# EasyEDA Pro project CyberryPotter.epro

# Schematic Development
Board Name: Development; Create Date: 2024-08-22; Page Name: P1; Project Name: 赛博魔杖_STM32卷积神经网络; Schematic Name: Development; Update Date: 2024-08-23; Company: 嘉立创EDA; Page Size: A4; Version: V1.0
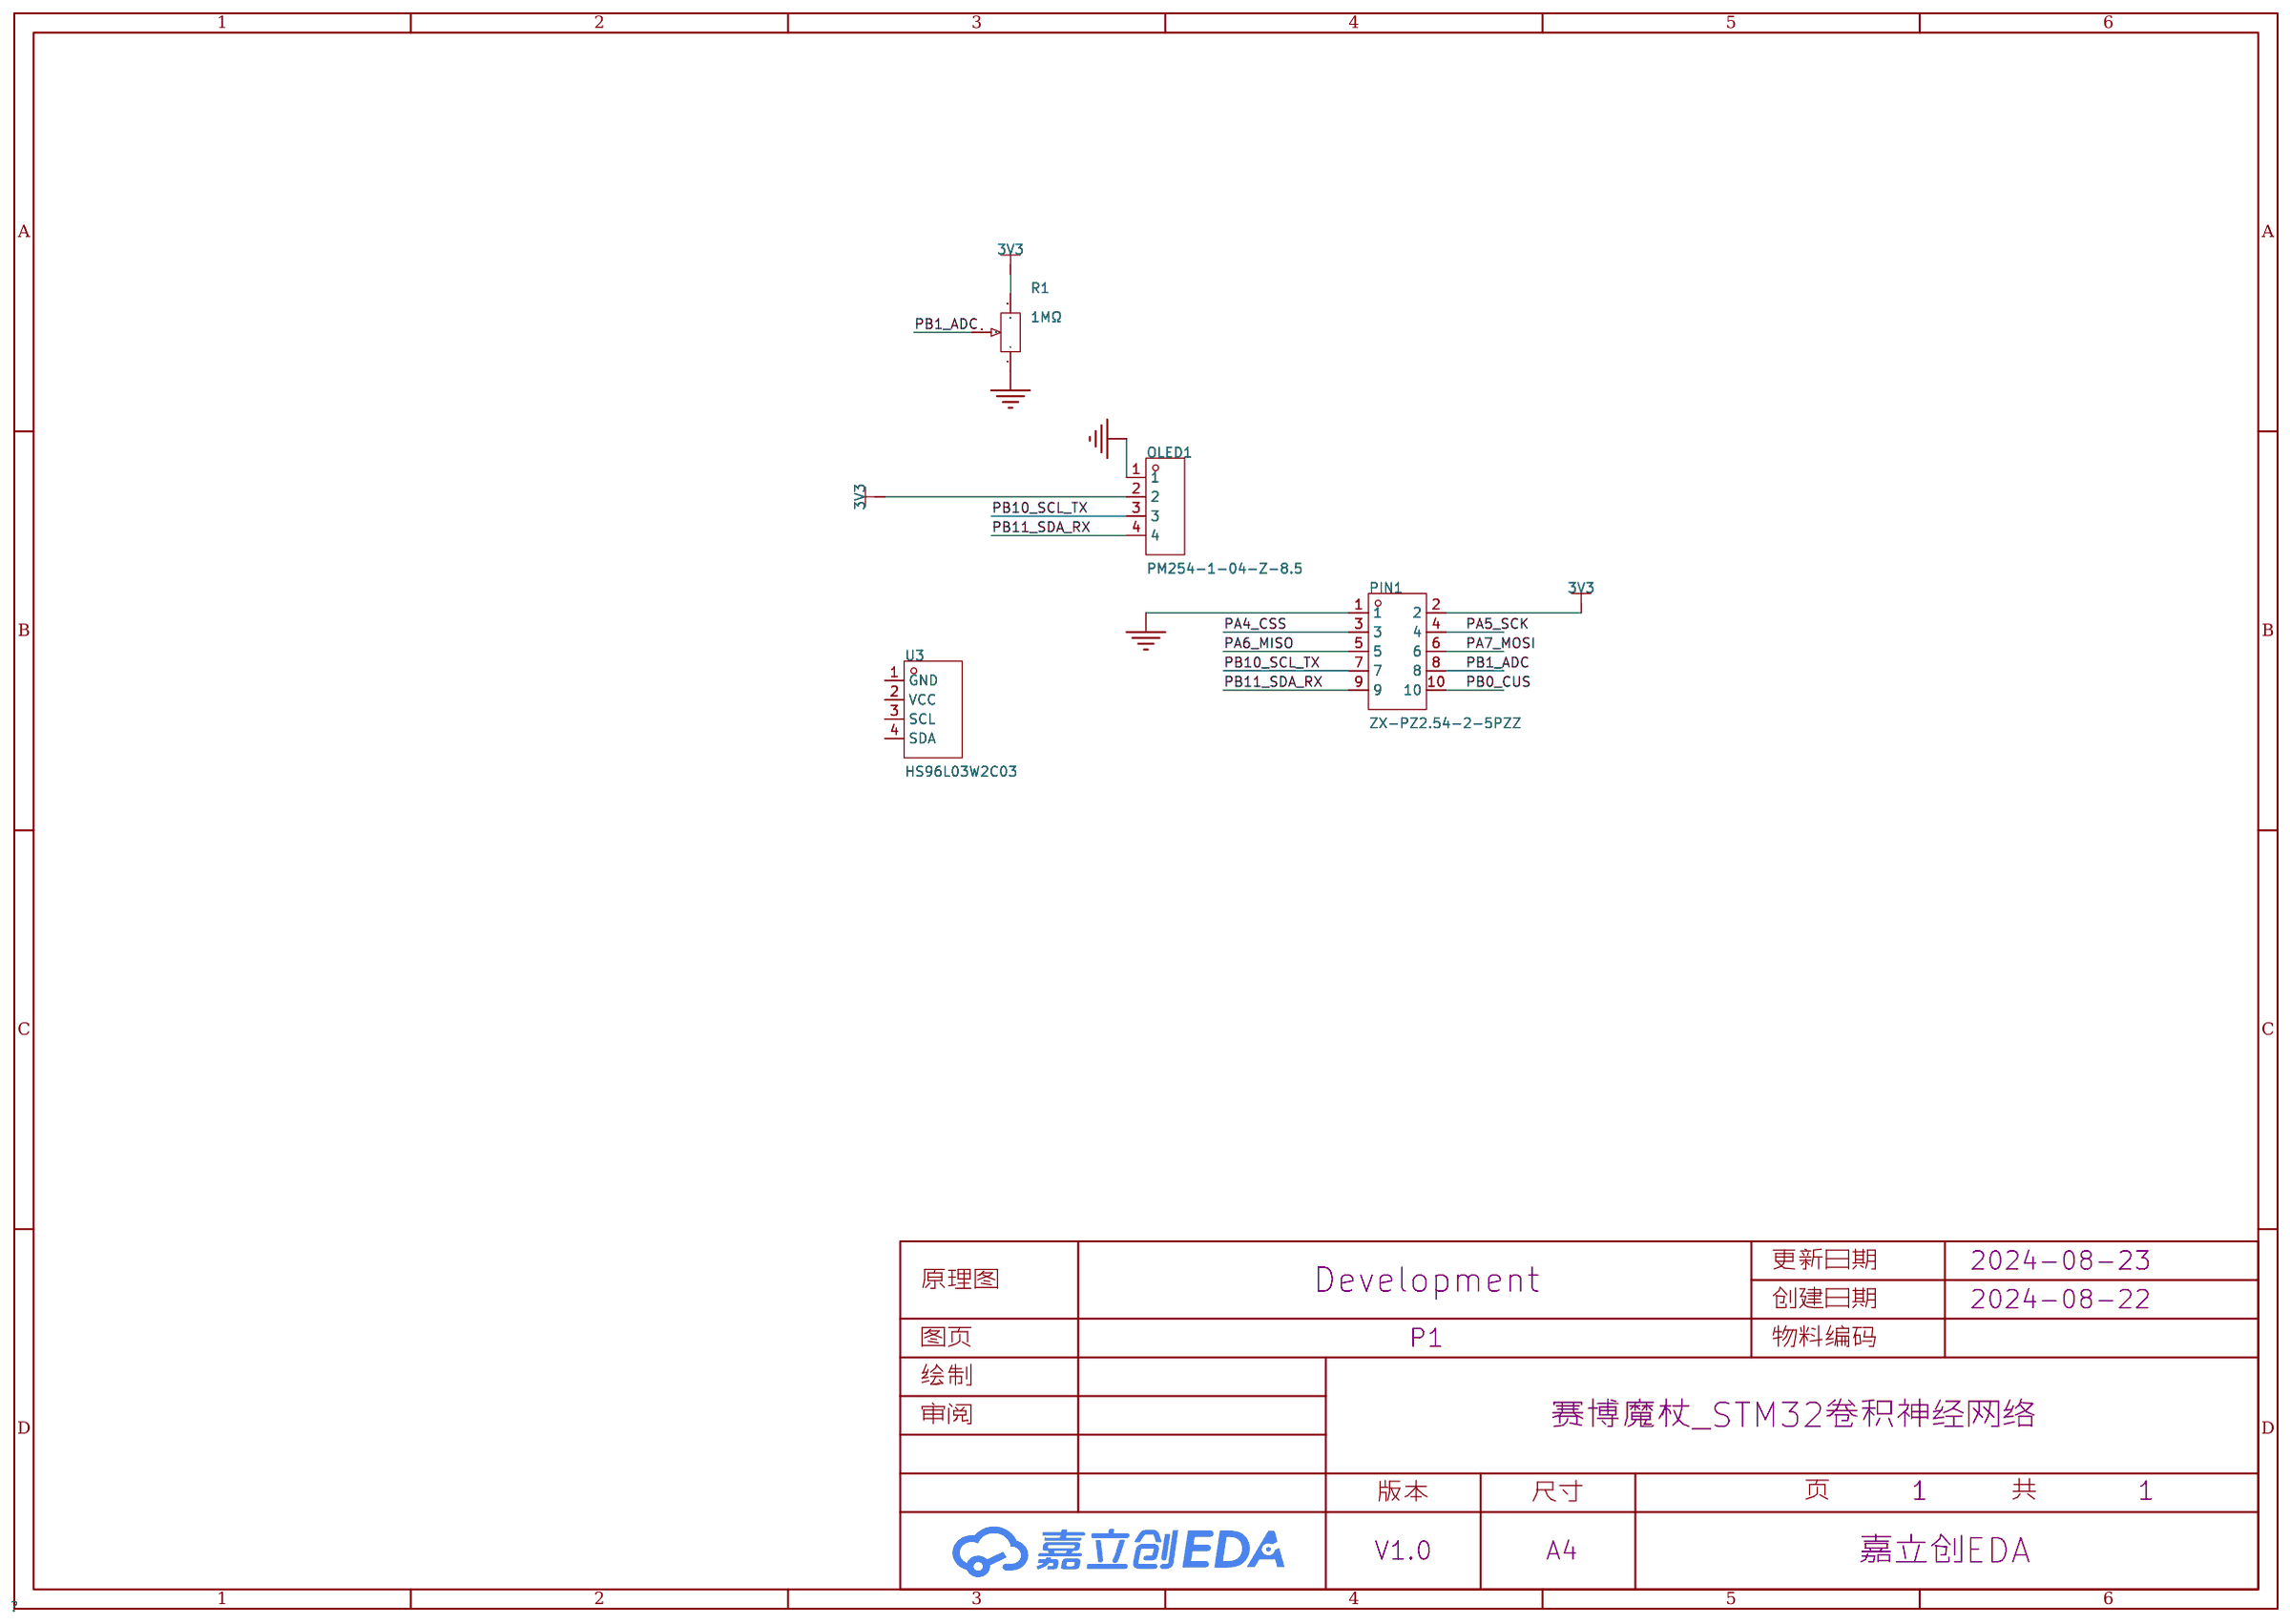
[diagram p0: schematic sheet]

## Parts
OLED1  PM254-1-04-Z-8.5  [HDR-TH_4P-P2.54-V-F]
PIN1  ZX-PZ2.54-2-5PZZ  [HDR-TH_10P-P2.54-V-M-R2-C5-S2.54]
R1  1MΩ  [RES-ADJ-TH_3P-L9.5-W4.9-P2.50-L_3296W]
U3  HS96L03W2C03  [OLED-TH_L27.8-W27.2-P2.54_C9900033791]

## Library data of the parts
OLED1 = PM254-1-04-Z-8.5_C2897367: 插孔结构:1x4P;间距:2.54mm;行距:-;圆孔/方孔:方孔;安装类型:直插;排数:单排;总孔位数:4P;额定电流:3A;额定电压:-;插孔方向:顶部;塑高:8.5mm;触头材质:铜合金;工作温度范围:-40℃~+105℃;焊接温度(最大值):260℃@5S;; LCSC Part Name: 1x4P 间距:2.54mm 直插; Supplier Part: C2897367; Manufacturer: HCTL(华灿天禄); Supplier Footprint: 插件,P=2.54mm; JLCPCB Part Class: 扩展库; Datasheet: https://atta.szlcsc.com/upload/public/pdf/source/20230609/534BE42964C679BDE98E061007C4ABD6.pdf; Supplier: LCSC; Holes Structure: 1x4P; Pitch: 2.54mm; Circular Hole / Square Hole: 方孔; Mounting Type: 直插; Number of Rows: 单排; Number of Holes: 4P; Current Rating (Max): 3A; Holes Direction: 顶部; Insulation Height: 8.5mm; Contact Material: 铜合金; Operating Temperature Range: -40℃~+105℃; Soldering Temperature(Max): 260℃@5S
PIN1 = ZX-PZ2.54-2-5PZZ: 插针结构:2x5P;间距:2.54mm;行距:2.54mm;圆针/方针:方针;安装类型:直插;排数:双排;总PIN位数:10P;额定电流:3A;额定电压:1kV;配合针长度:6mm;塑高:2.5mm;端接针长度:3mm;触头材质:黄铜;触头镀层:金;工作温度范围:-40℃~+105℃;焊接温度(最大值):-;颜色:黑色;; LCSC Part Name: 2x5P 间距:2.54mm 方针 直插; Supplier Part: C7501276; Manufacturer: Megastar(兆星); Supplier Footprint: 插件,P=2.54mm; JLCPCB Part Class: 扩展库; Datasheet: https://atta.szlcsc.com/upload/public/pdf/source/20231122/7DD2FA5A7FDBC10CDDB6051CB6BC6AD1.pdf; Supplier: LCSC; Pin Structure: 2x5P; Pitch: 2.54mm; Row Spacing: 2.54mm; Circluar Pins/Square Pins: 方针; Mounting Type: 直插; Number of Rows: 双排; Number of Pins: 10P; Current Rating (Max): 3A; Voltage Rating (Max): 1kV; Length of Mating Pin: 6mm; Insulation Height: 2.5mm; Length of End Connection Pin: 3mm; Contact Material: 黄铜; Contact Plating: 金; Operating Temperature Range: -40℃~+105℃; Color: 黑色
R1 = 3296W-1-104: 阻值:100kΩ;精度:±10%;; LCSC Part Name: 100kΩ ±10%; Supplier Part: C118963; Manufacturer: BOCHEN(博晨); Supplier Footprint: 插件; JLCPCB Part Class: 扩展库; Datasheet: https://atta.szlcsc.com/upload/public/pdf/source/20171114/C118963_15106326662041117450.pdf; Supplier: LCSC; Tolerance: ±10%
U3 = HS96L03W2C03: 主控芯片:SSD1315;接口类型:I2C;尺寸(inch):0.96;像素分辨率:128x64;; LCSC Part Name: 0.96寸OLED显示屏窄白光IIC; Supplier Part: C5248080; Manufacturer: HS(汉昇); JLCPCB Part Class: 扩展库; Datasheet: https://atta.szlcsc.com/upload/public/pdf/source/20230627/763D01F79A90007632F098068C7C8AD9.pdf; Supplier: LCSC; Main Control Chip: SSD1315; Interface Type: I2C; Size: 0.96; Pixel Resolution: 128x64; Operating Temperature: -40℃~+70℃

## Nets
3V3: OLED1.2 PIN1.2 R1.3
GND: OLED1.1 PIN1.1 R1.1
PA4_CSS: PIN1.3
PA5_SCK: PIN1.4
PA6_MISO: PIN1.5
PA7_MOSI: PIN1.6
PB0_CUS: PIN1.10
PB1_ADC: PIN1.8 R1.2
PB10_SCL_TX: OLED1.3 PIN1.7
PB11_SDA_RX: OLED1.4 PIN1.9

Not connected (* = marked no-connect by the designer): U3 1(GND) 2(VCC) 3(SCL) 4(SDA)

# Schematic IR
Board Name: IR; Create Date: 2024-08-22; Page Name: P1; Project Name: 赛博魔杖_STM32卷积神经网络; Schematic Name: IR; Update Date: 2024-08-22
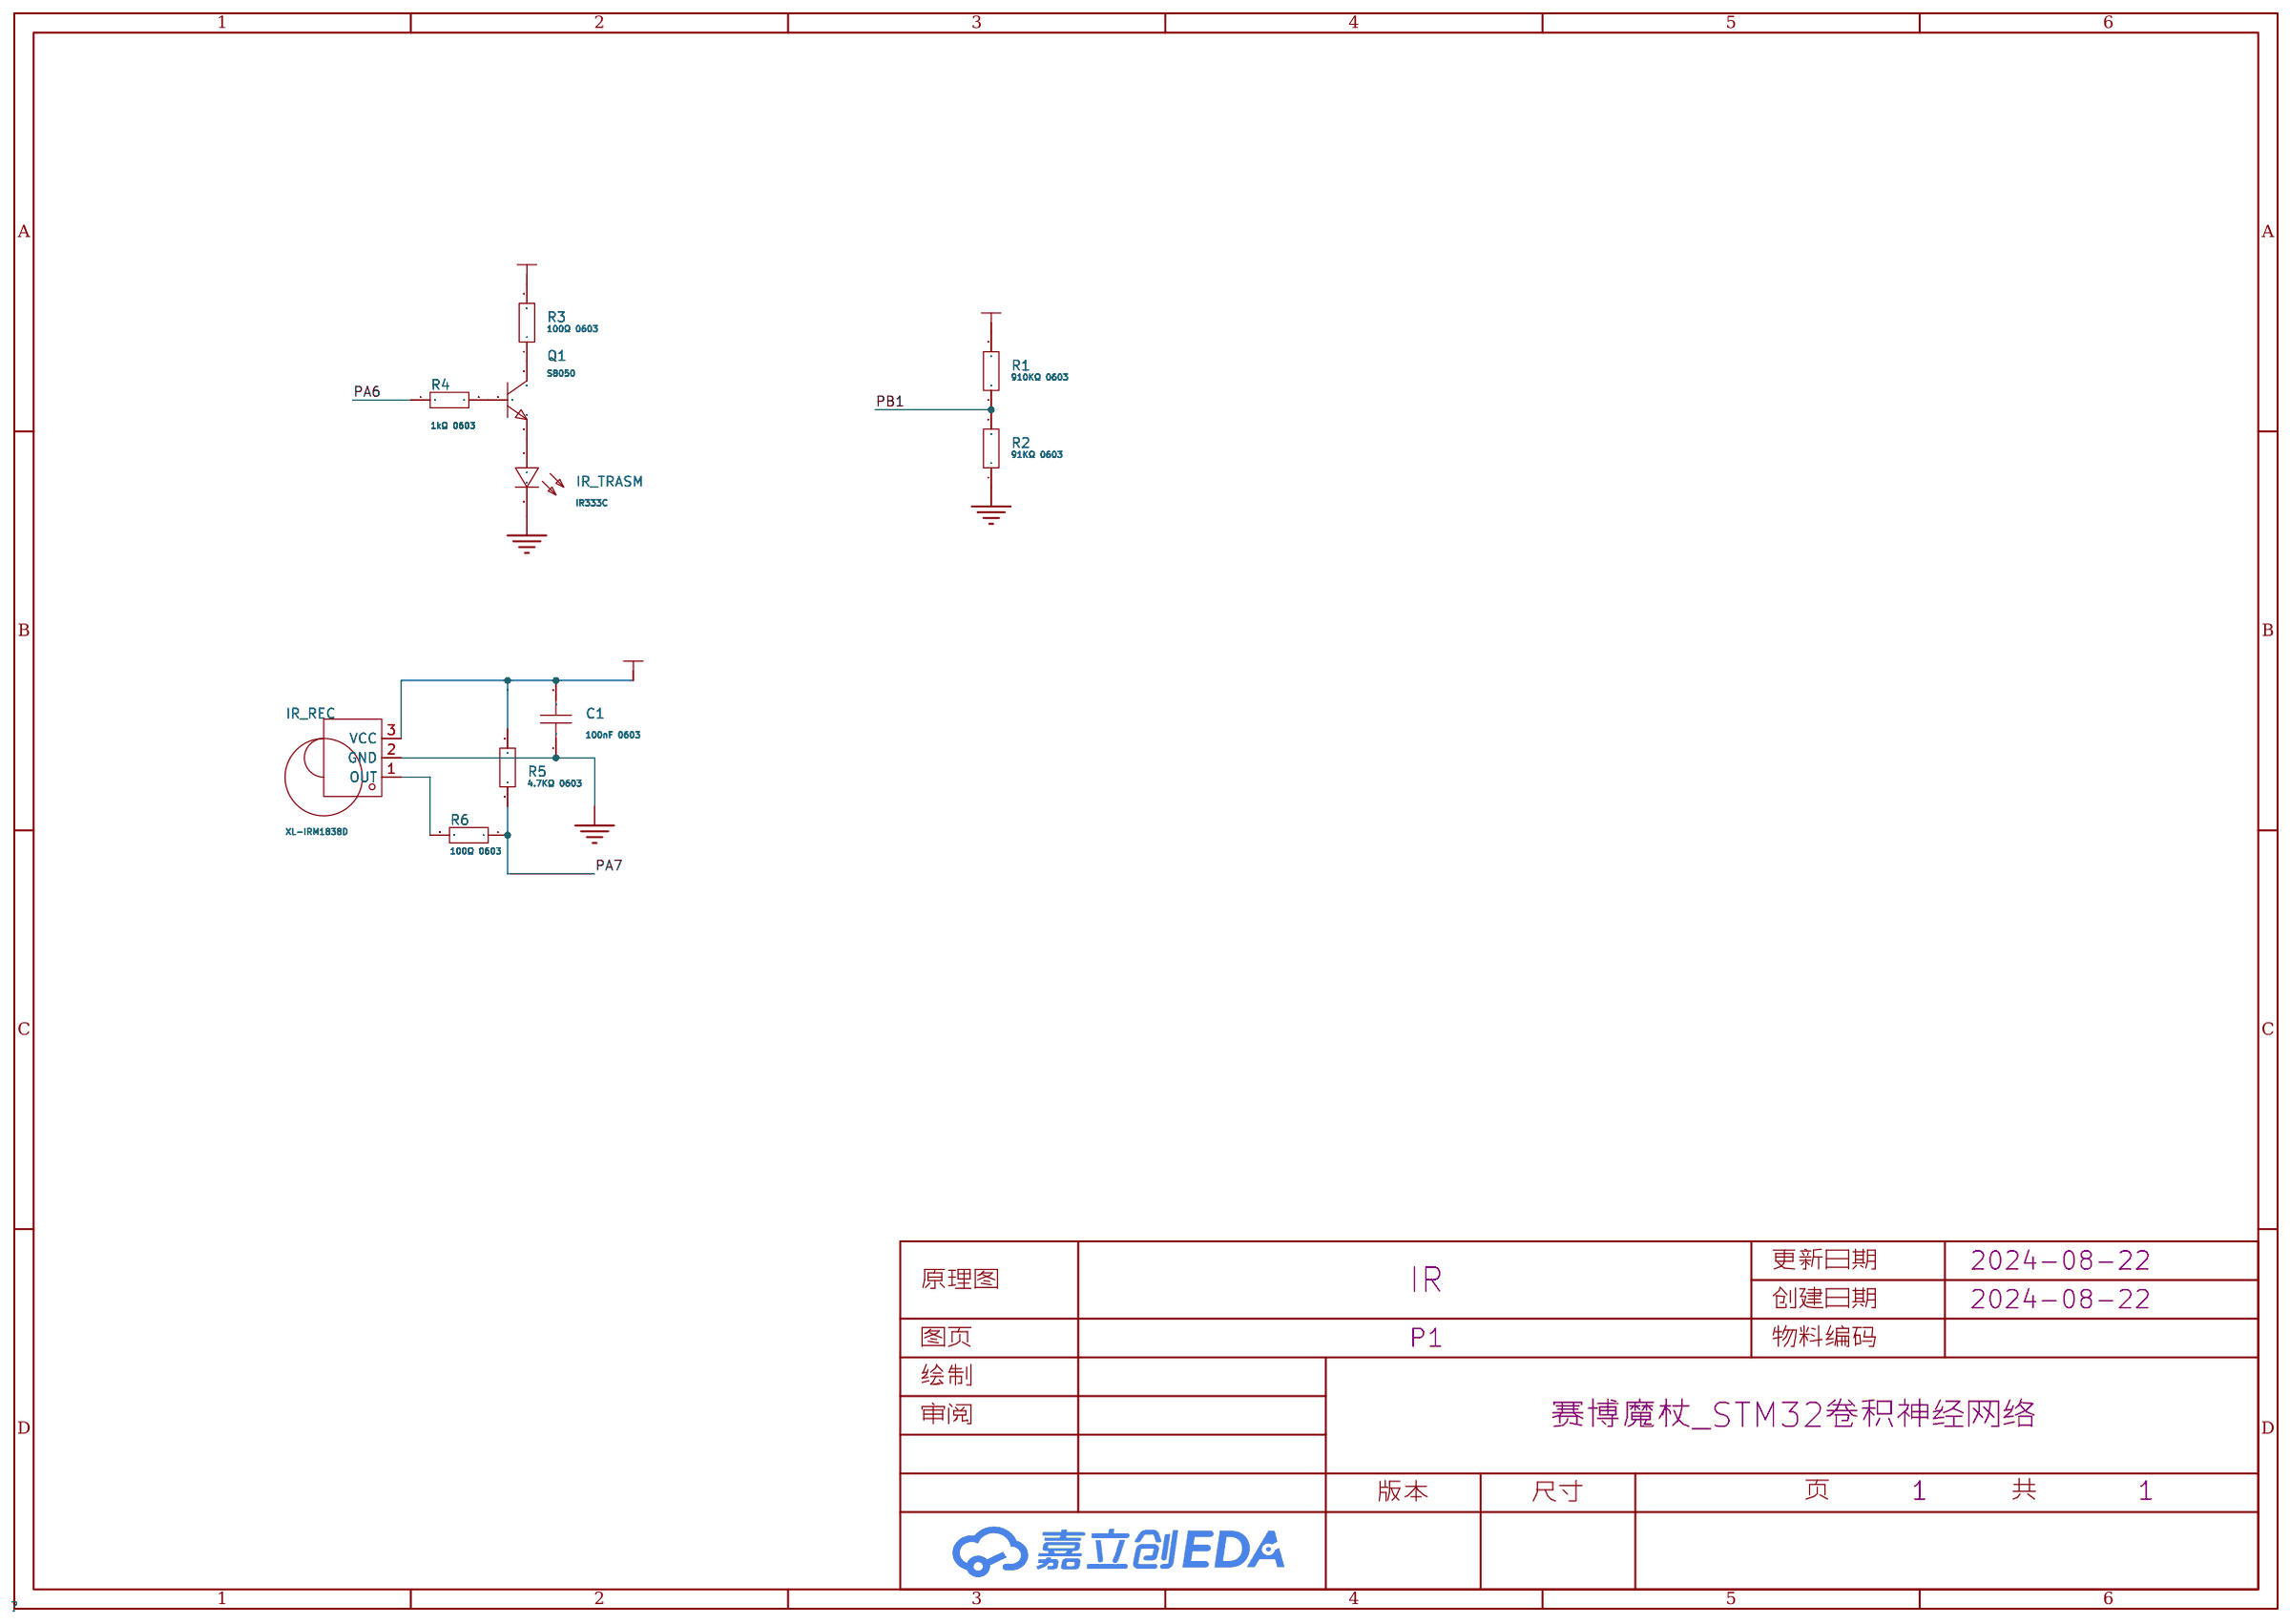
[diagram p1: schematic sheet]

## Parts
C1  100nF 0603  [C0603]
IR_REC  XL-IRM1838D  [OPTO-TH_3P-L7.0-W5.6-P2.54-L]
IR_TRASM  IR333C  [LED-TH_BD5.0-P2.54-FD]
Q1  S8050  [SOT-23-3_L2.9-W1.6-P1.90-LS2.8-BR]
R1  910KΩ 0603  [R0603]
R2  91KΩ 0603  [R0603]
R3  100Ω 0603  [R0603]
R4  1kΩ 0603  [R0603]
R5  4.7KΩ 0603  [R0603]
R6  100Ω 0603  [R0603]

## Library data of the parts
C1 = CC0603KRX7R9BB104: 容值:100nF;精度:±10%;额定电压:50V;材质(温度系数):X7R;; LCSC Part Name: 100nF ±10% 50V; Supplier Part: C14663; Manufacturer: YAGEO(国巨); Supplier Footprint: 0603; JLCPCB Part Class: 基础库; Datasheet: https://atta.szlcsc.com/upload/public/pdf/source/20180910/C282072_33301C7F631E79921B82A8DAC6BCC5B3.pdf; Supplier: LCSC; Tolerance: ±10%; Voltage Rated: 50V; Temperature Coefficient: X7R
IR_REC = XL-IRM1838D: D=7MM;载波频率：37.9KHZ;VDD=2.7-5.5V/插件式红外接收头;低功耗；宽角度及长距离接收/能抵挡环境干扰; Supplier Part: C19725374; Manufacturer: XINGLIGHT(成兴光); Supplier Footprint: SIP-3; JLCPCB Part Class: 扩展库; Datasheet: https://atta.szlcsc.com/upload/public/pdf/source/20240218/FB82743A9784255017BE11F358F9C065.pdf; Supplier: LCSC
IR_TRASM = IR333C: 正向电压:1.2V;波长:940nm;辐射强度:7.8mW/sr@20mA;视角:20°;; LCSC Part Name: 5mm红外LED; Supplier Part: C5200795; Manufacturer: EVERLIGHT(亿光); Supplier Footprint: 插件; JLCPCB Part Class: 扩展库; Datasheet: https://atta.szlcsc.com/upload/public/pdf/source/20221214/25ED07650BA98783E37095EC49136A18.pdf; Supplier: LCSC; Vf - Forward Voltage: 1.2V; Wavelength: 940nm; Radiant Intensity: 7.8mW/sr@20mA; View Angle: 20°; Operating Temperature: -40℃~+85℃
Q1 = S8050_C181158: 晶体管类型:NPN;集电极电流(Ic):500mA;集射极击穿电压(Vceo):25V;功率(Pd):300mW;; LCSC Part Name: NPN 电流:500mA 耐压:25V; Supplier Part: C181158; Manufacturer: Hottech(合科泰); Supplier Footprint: SOT-23; JLCPCB Part Class: 扩展库; Datasheet: https://atta.szlcsc.com/upload/public/pdf/source/20220506/D987F39D56F2975D34EC7947E75C4ABC.pdf; Supplier: LCSC; Transistor Type: NPN; Collector Current (Ic): 500mA; Collector-Emitter Breakdown Voltage (Vceo): 25V; Power Dissipation (Pd): 300mW; Transition Frequency (fT): 150MHz; Collector Cut-Off Current (Icbo): 100nA; Collector-Emitter Saturation Voltage (VCE(sat)@Ic,Ib): 600mV@500mA,50mA
R1-R6 = 0603WAF1002T5E: 电阻类型:厚膜电阻;阻值:10kΩ;精度:±1%;功率:100mW;最大工作电压:75V;温度系数:±100ppm/℃;; LCSC Part Name: 厚膜电阻 10kΩ ±1% 100mW; Supplier Part: C25804; Manufacturer: UNI-ROYAL(厚声); Supplier Footprint: 0603; JLCPCB Part Class: 基础库; Datasheet: https://atta.szlcsc.com/upload/public/pdf/source/20200306/C422600_1E6D84923E4A46A82E41ADD87F860B5C.pdf; Supplier: LCSC; Type: 厚膜电阻; Tolerance: ±1%; Power(Watts): 100mW; Overload Voltage (Max): 75V; Temperature Coefficient: ±100ppm/℃; Operating Temperature Range: -55℃~+155℃

## Nets
3V3: C1.2 IR_REC.3(VCC) R1.2 R3.2 R5.1
GND: C1.1 IR_REC.2(GND) IR_TRASM.2(C) R2.1
PA6: R4.1
PA7: R5.2 R6.1
PB1: R1.1 R2.2
$1N195: IR_TRASM.1(A) Q1.2
$1N793: Q1.1 R4.2
$1N835: Q1.3 R3.1
$1N1035: IR_REC.1(OUT) R6.2

# Schematic Main
Board Name: Main; Create Date: 2024-08-22; Page Name: P1; Project Name: 赛博魔杖_STM32卷积神经网络; Schematic Name: Main; Update Date: 2024-08-22
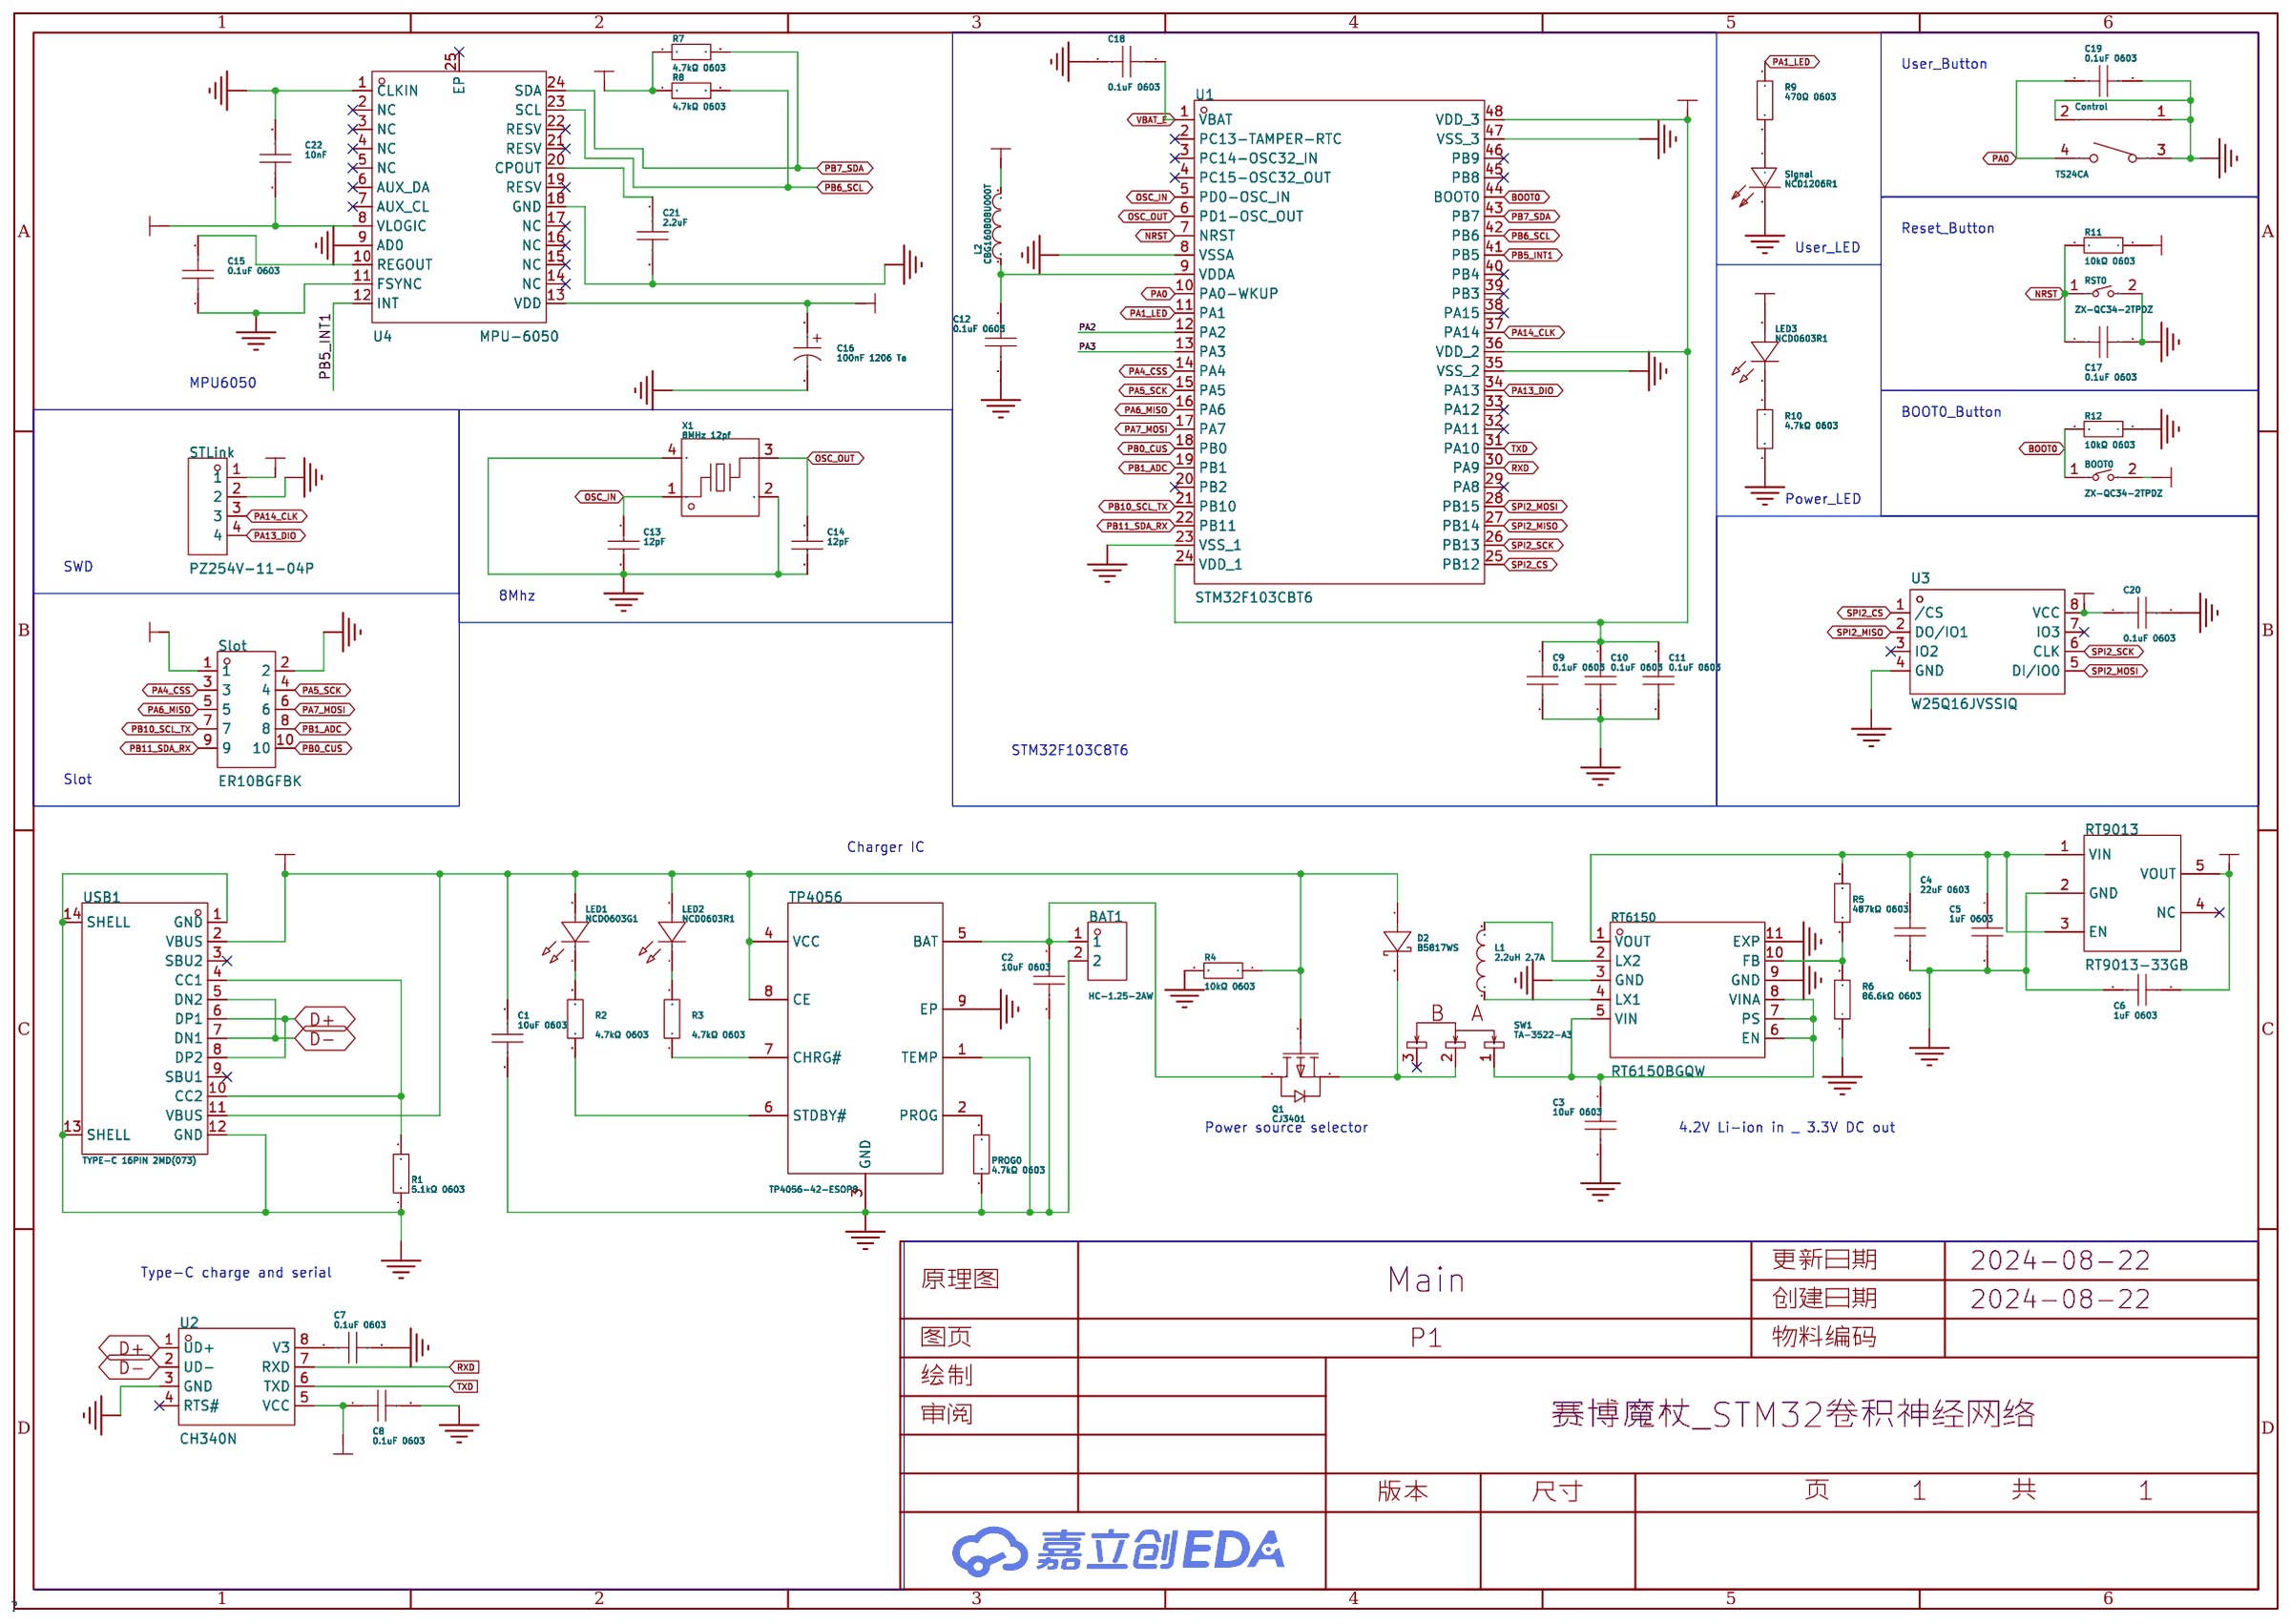
[diagram p2: schematic sheet]

## Parts
BAT1  HC-1.25-2AW  [CONN-TH_2P-P1.25_HCTL_HC-1.25-2AW]
BOOT0  ZX-QC34-2TPDZ  [KEY-SMD_L3.9-W3.0-LS5.0-EH]
C1  10uF 0603  [C0603]
C2  10uF 0603  [C0603]
C3  10uF 0603  [C0603]
C4  22uF 0603  [C0603]
C5  1uF 0603  [C0603]
C6  1uF 0603  [C0603]
C7  0.1uF 0603  [C0603]
C8  0.1uF 0603  [C0603]
C9  0.1uF 0603  [C0603]
C10  0.1uF 0603  [C0603]
C11  0.1uF 0603  [C0603]
C12  0.1uF 0603  [C0603]
C13  12pF  [C0603]
C14  12pF  [C0603]
C15  0.1uF 0603  [C0603]
C16  100nF 1206 Ta  [CAP-SMD_L3.2-W1.6-RD]
C17  0.1uF 0603  [C0603]
C18  0.1uF 0603  [C0603]
C19  0.1uF 0603  [C0603]
C20  0.1uF 0603  [C0603]
C21  2.2uF  [C0603]
C22  10nF  [C0603]
Control  TS24CA  [SW-SMD_TS24CA]
D2  B5817WS  [SOD-323_L1.7-W1.3-LS2.5-FD]
L1  2.2uH 2.7A  [IND-SMD_L2.5-W2.0]
L2  CBG160808U000T  [L0603]
LED1  NCD0603G1  [LED0603-RD]
LED2  NCD0603R1  [LED0603-RD_RED]
LED3  NCD0603R1  [LED0603-RD_RED]
PROG0  4.7kΩ 0603  [R0603]
Q1  CJ3401  [SOT-23-3_L2.9-W1.6-P1.90-LS2.8-BR]
R1  5.1kΩ 0603  [R0603]
R2  4.7kΩ 0603  [R0603]
R3  4.7kΩ 0603  [R0603]
R4  10kΩ 0603  [R0603]
R5  487kΩ 0603  [R0603]
R6  86.6kΩ 0603  [R0603]
R7  4.7kΩ 0603  [R0603]
R8  4.7kΩ 0603  [R0603]
R9  470Ω 0603  [R0603]
R10  4.7kΩ 0603  [R0603]
R11  10kΩ 0603  [R0603]
R12  10kΩ 0603  [R0603]
RST0  ZX-QC34-2TPDZ  [KEY-SMD_L3.9-W3.0-LS5.0-EH]
RT6150  RT6150BGQW  [WSON-10_L2.5-W2.5-P0.50-BL-EP]
RT9013  RT9013-33GB  [SOT-23-5_L3.0-W1.7-P0.95-LS2.8-BL]
Signal  NCD1206R1  [LED1206-R-RD_RED]
Slot  ER10BGFBK  [CONN-TH_10P-P2.54_WINGTAT_ER10BGFBK]
STLink  PZ254V-11-04P  [HDR-TH_4P-P2.54-V-M]
SW1  TA-3522-A3  [SW-TH_3P-L9.1-W3.5-P2.50-A3]
TP4056  TP4056-42-ESOP8  [ESOP-8_L4.9-W3.9-P1.27-LS6.0-BL-EP]
U1  STM32F103CBT6  [LQFP-48_L7.0-W7.0-P0.50-LS9.0-BL]
U2  CH340N  [SOP-8_L4.9-W3.9-P1.27-LS6.0-BL]
U3  W25Q16JVSSIQ  [SOIC-8_L5.3-W5.3-P1.27-LS8.0-BL]
U4  MPU-6050  [QFN-24_L4.0-W4.0-P0.50-BL-EP2.7]
USB1  TYPE-C 16PIN 2MD(073)  [USB-C-SMD_TYPE-C-6PIN-2MD-073]
X1  8MHz 12pf  [OSC-SMD_4P-L3.2-W2.5-BL]

## Library data of the parts
BAT1 = HC-1.25-2AW: 插针结构:1x2P;间距:1.25mm;安装方式:弯插;参考系列:-;总PIN数:2P;排数:1;每排PIN数:2;行距:-;额定电流:1A;触头材质:黄铜;触头镀层:锡;工作温度范围:-25℃~+85℃;; LCSC Part Name: 1x2P 间距:1.25mm 弯插; Supplier Part: C2845535; Manufacturer: HCTL(华灿天禄); Supplier Footprint: 弯插,P=1.25mm; JLCPCB Part Class: 扩展库; Datasheet: https://atta.szlcsc.com/upload/public/pdf/source/20230707/04F6BEA69F699E7BB6558EF06AF1DC24.pdf; Supplier: LCSC; Pins Structure: 1x2P; Pitch: 1.25mm; Mounting Style: 弯插; Number of Pins: 2P; Number of Rows: 1; Number of PINs Per Row: 2; Current Rating (Max): 1A; Contact Material: 黄铜; Contact Plating: 锡; Operating Temperature Range: -25℃~+85℃
BOOT0 RST0 = ZX-QC34-2TPDZ: 电路结构:单刀单掷;按钮形状:圆形按钮;作用力:2.6N;安装方式:立贴;开关长度:3mm;开关宽度:4mm;开关高度:2mm;带支架:不带;触点电流:50mA;额定电压(AC):250V;额定电压(DC):12V;绝缘电阻:100MΩ;机械寿命:10万次;; LCSC Part Name: 3*4*2贴片开关带柱; Supplier Part: C7470219; Manufacturer: Megastar(兆星); Supplier Footprint: SMD; JLCPCB Part Class: 扩展库; Datasheet: https://atta.szlcsc.com/upload/public/pdf/source/20230724/D2731FAADF93973E25928DE23F241F8A.pdf; Supplier: LCSC; Circuit: 单刀单掷; Actuator Style: 圆形按钮; Operating Force: 2.6N; Mounting Style: 立贴; Switch Length: 3mm; Switch Width: 4mm; Switch Height: 2mm; Strike Gundam: 不带; Contact Current: 50mA; Voltage Rating (AC): 250V; Voltage Rating (DC): 12V; Insulation Resistance: 100MΩ; Actuator/Cap Color: 黑色; Pin Style: 鸥翼型; Mechanical Life: 10万次; Operating Temperature: -30℃~+80℃
C1-C12 C15 C17-C20 = CC0603JRNPO9BN101: 容值:100pF;精度:±5%;额定电压:50V;材质(温度系数):NP0;; LCSC Part Name: 100pF ±5% 50V; Supplier Part: C14665; Manufacturer: YAGEO(国巨); Supplier Footprint: 0603; JLCPCB Part Class: 扩展库; Datasheet: https://atta.szlcsc.com/upload/public/pdf/source/20181008/C309499_21CC21451B82C39E3D92150FD6B30293.pdf; Supplier: LCSC; Tolerance: ±5%; Voltage Rated: 50V; Temperature Coefficient: NP0
C13 C14 = CC0603JRNPO9BN200: 容值:20pF;精度:±5%;额定电压:50V;材质(温度系数):NP0;; LCSC Part Name: 20pF ±5% 50V; Supplier Part: C105621; Manufacturer: YAGEO(国巨); Supplier Footprint: 0603; JLCPCB Part Class: 扩展库; Datasheet: https://atta.szlcsc.com/upload/public/pdf/source/20170505/1493957838062.pdf; Supplier: LCSC; Tolerance: ±5%; Voltage Rated: 50V; Temperature Coefficient: NP0
C16 = CA45-A-35V-0.1UF-K: 容值:100nF;精度:±10%;额定电压:35V;; LCSC Part Name: 100nF ±10% 35V; Supplier Part: C2976900; Manufacturer: CEC(振华新云); Supplier Footprint: SMD,1.6x3.2mm; JLCPCB Part Class: 扩展库; Datasheet: https://atta.szlcsc.com/upload/public/pdf/source/20220222/C2C5F368BEBB90E653B4407F98E5644A.pdf; Supplier: LCSC; Tolerance: ±10%; Rated Voltage: 35V; Operating Temperature: -55℃~+125℃
C21 = CL10A225KO8NNNC: 容值:2.2uF;精度:±10%;额定电压:16V;材质(温度系数):X5R;; LCSC Part Name: 2.2uF ±10% 16V; Supplier Part: C23630; Manufacturer: SAMSUNG(三星); Supplier Footprint: 0603; JLCPCB Part Class: Basic Part; Datasheet: https://atta.szlcsc.com/upload/public/pdf/source/20160218/1457707763339.pdf; Supplier: LCSC; Tolerance: ±10%; Voltage Rated: 16V; Temperature Coefficient: X5R
C22 = CC0603KRX7R9BB103: 容值:10nF;精度:±10%;额定电压:50V;材质(温度系数):X7R;; LCSC Part Name: 10nF ±10% 50V; Supplier Part: C100042; Manufacturer: YAGEO(国巨); Supplier Footprint: 0603; JLCPCB Part Class: Extended Part; Datasheet: https://atta.szlcsc.com/upload/public/pdf/source/20181008/C309510_22F155564471FAF6A489F7D68F34234E.pdf; Supplier: LCSC; Tolerance: ±10%; Voltage Rated: 50V; Temperature Coefficient: X7R
Control = TS24CA: 电路结构:单刀单掷;按钮形状:矩形按钮;安装方式:卧贴;开关长度:4.55mm;开关宽度:1.8mm;开关高度:3.5mm;触点电流:50mA;额定电压(DC):12V;带灯:-;机械寿命:-;; LCSC Part Name: 4.55*1.8*3.5mm 卧贴 轻触开关; Supplier Part: C393942; Manufacturer: SHOU HAN(首韩); Supplier Footprint: SMD; JLCPCB Part Class: 扩展库; Datasheet: https://atta.szlcsc.com/upload/public/pdf/source/20190521/C393942_591A9E318887EFA4274D34029981AD99.pdf; Supplier: LCSC; Circuit: 单刀单掷; Actuator Style: 矩形按钮; Mounting Style: 卧贴; Switch Length: 4.55mm; Switch Width: 1.8mm; Switch Height: 3.5mm; Contact Current: 50mA; Voltage Rating (DC): 12V
D2 = B5817WS_C7420329: 二极管配置:独立式;正向压降(Vf):450mV@1.0A;直流反向耐压(Vr):20V;平均整流电流(Io):1A;; LCSC Part Name: 电压:20V 电流:1A; Supplier Part: C7420329; Manufacturer: 宏迦橙; Supplier Footprint: SOD-323; JLCPCB Part Class: 扩展库; Datasheet: https://atta.szlcsc.com/upload/public/pdf/source/20230828/03CA0F4F90DAE368A7153B7B5E4D0651.pdf; Supplier: LCSC; Diode Configuration: 独立式; Forward Voltage (Vf@If): 450mV@1.0A; Reverse Voltage (Vr): 20V; Average Rectified Current (Io): 1A; Reverse Leakage Current (Ir): 1mA@20V
L1 = SRN2512-2R2M: 电感值:2.2uH;精度:±20%;额定电流:2.3A;饱和电流(Isat):2.7A;类型:-;; LCSC Part Name: 2.2uH ±20% 2.7A; Supplier Part: C2041574; Manufacturer: BOURNS; Supplier Footprint: 1008; JLCPCB Part Class: 扩展库; Datasheet: https://atta.szlcsc.com/upload/public/pdf/source/20210630/9277016DFE24E5B118E2E0BE21877B47.pdf; Supplier: LCSC; Tolerance: ±20%; Rated Current: 2.3A; Saturation Current (Isat): 2.7A; DC Resistance (DCR): 102mΩ
L2 = CBG160808U000T: 标称阻抗@测试频率:0Ω@100MHz;直流电阻(RDC):100mΩ;; LCSC Part Name: 单路 0603磁珠 阻抗0Ω@100MHz; Supplier Part: C43163; Manufacturer: FH(风华); Supplier Footprint: 0603; JLCPCB Part Class: 扩展库; Datasheet: https://atta.szlcsc.com/upload/public/pdf/source/20190129/C361667_1614D407CC98D1D3CFBD9E1F7511C14D.pdf; Supplier: LCSC; Impedance @ Frequency: 0Ω@100MHz; DC Resistance: 100mΩ; Current Rating: 800mA; Circuits: 1
LED1 = NCD0603G1: 发光颜色:翠绿色;正向电压(VF):2.6V~3.6V;功率:72mW;正向电流:10mA;主波长:515nm~530nm;透镜颜色:无色透明透镜;发光强度:330mcd~900mcd;发光角度:130°;工作温度:-30℃~+85℃;; Supplier Part: C84267; Manufacturer: 国星光电; Supplier Footprint: 0603; JLCPCB Part Class: Extended Part; Datasheet: https://atta.szlcsc.com/upload/public/pdf/source/20200820/C84267_04BA7703640BAC111D09F5EFB971FBF3.pdf; Supplier: LCSC; Emitted Color: 翠绿色; Forward Voltage (VF): 2.6V~3.6V; Power Dissipation: 72mW; Forward Current: 10mA; Dominant Wavelength: 515nm~530nm; Lens Color: 无色透明透镜; Luminous Intensity: 330mcd~900mcd; Viewing Angle: 130°; Operating Temperature: -30℃~+85℃; Peak Wavelength: 525nm
LED2 LED3 = NCD0603R1_C84263: 灯头类型:-;发光颜色:红色;正向电压(VF):1.6V~2.6V;功率:65mW;正向电流:20mA;主波长:615nm~630nm;二极管配置:独立二极管;透镜颜色:无色透明透镜;色温:-;发光强度:80mcd~220mcd;发光角度:130°;载带方式:-;工作温度:-30℃~+85℃;; Supplier Part: C84263; Manufacturer: 国星光电; Supplier Footprint: 0603; JLCPCB Part Class: Extended Part; Datasheet: https://atta.szlcsc.com/upload/public/pdf/source/20200820/C84263_DABC6A75E58F576973B407FDBA283D60.pdf; Supplier: LCSC; Emitted Color: 红色; Forward Voltage (VF): 1.6V~2.6V; Power Dissipation: 65mW; Forward Current: 20mA; Dominant Wavelength: 615nm~630nm; Diode Configuration: 独立二极管; Lens Color: 无色透明透镜; Luminous Intensity: 80mcd~220mcd; Viewing Angle: 130°; Operating Temperature: -30℃~+85℃
PROG0 R1-R12 = 0603WAF1002T5E: 电阻类型:厚膜电阻;阻值:10kΩ;精度:±1%;功率:100mW;最大工作电压:75V;温度系数:±100ppm/℃;; LCSC Part Name: 厚膜电阻 10kΩ ±1% 100mW; Supplier Part: C25804; Manufacturer: UNI-ROYAL(厚声); Supplier Footprint: 0603; JLCPCB Part Class: 基础库; Datasheet: https://atta.szlcsc.com/upload/public/pdf/source/20200306/C422600_1E6D84923E4A46A82E41ADD87F860B5C.pdf; Supplier: LCSC; Type: 厚膜电阻; Tolerance: ±1%; Power(Watts): 100mW; Overload Voltage (Max): 75V; Temperature Coefficient: ±100ppm/℃; Operating Temperature Range: -55℃~+155℃
Q1 = CJ3401: 类型:1个P沟道;漏源电压(Vdss):30V;连续漏极电流(Id):4.2A;功率(Pd):350mW;导通电阻(RDS(on)@Vgs,Id):65mΩ@10V,4.2A;阈值电压(Vgs(th)@Id):1.3V@250uA;; LCSC Part Name: 1个P沟道 耐压:30V 电流:4.2A; Supplier Part: C13799; Manufacturer: CJ(江苏长电/长晶); Supplier Footprint: SOT-23; JLCPCB Part Class: 扩展库; Datasheet: https://atta.szlcsc.com/upload/public/pdf/source/20140815/1457707217656.pdf; Supplier: LCSC; Type: 1个P沟道; Drain Source Voltage (Vdss): 30V; Continuous Drain Current (Id): 4.2A; Power Dissipation (Pd): 350mW; Drain Source On Resistance (RDS(on)@Vgs,Id): 65mΩ@10V,4.2A; Gate Threshold Voltage (Vgs(th)@Id): 1.3V@250uA
RT6150 = RT6150BGQW: 功能类型:升降压型;输入电压:1.8V~5.5V;输出电压:1.8V~5.5V;输出电流(最大值):800mA;; Supplier Part: C147972; Manufacturer: RICHTEK(立锜); Supplier Footprint: WSON-10-EP(2.5x2.5); JLCPCB Part Class: 扩展库; Datasheet: https://atta.szlcsc.com/upload/public/pdf/source/20180126/C147972_15169561259341309260.pdf; Supplier: LCSC; Function: 升降压型; Input Voltage: 1.8V~5.5V; Output Voltage: 1.8V~5.5V; Output Current (Max): 800mA; Switching Frequency: 1MHz; Synchronous Rectification: 是; Number of Outputs: 1; Topology: 降压-升压式; Switch tube (built-in/external): 内置
RT9013 = RT9013-33GB: 输出类型:固定;最大输入电压:5.5V;输出电压:3.3V;最大输出电流:500mA;电源纹波抑制比(PSRR):50dB@(10kHz);输出极性:正极;; LCSC Part Name: 输入5.5V 输出3.3V 500mA; Supplier Part: C47773; Manufacturer: RICHTEK(立锜); Supplier Footprint: SOT-23-5; JLCPCB Part Class: 扩展库; Datasheet: https://atta.szlcsc.com/upload/public/pdf/source/20150504/1457707282459.pdf; Supplier: LCSC; Output Type: 固定; Maximum Input Voltage: 5.5V; Output Voltage: 3.3V; MAX Output Current: 500mA; Power Supply Rejection Ratio (PSRR): 50dB@(10kHz); Dropout Voltage: 400mV@(500mA); standby current: 50uA; Operating Temperature: -40℃~+85℃; Output Polarity: 正极; Number of Outputs: 1
Signal = NCD1206R1: 发光颜色:红色;正向电压(VF):1.6V~2.6V;功率:65mW;正向电流:20mA;主波长:615nm~630nm;透镜颜色:无色透明透镜;发光强度:67mcd~195mcd;发光角度:130°;工作温度:-30℃~+85℃;; Supplier Part: C84270; Manufacturer: 国星光电; Supplier Footprint: 1206; JLCPCB Part Class: Extended Part; Datasheet: https://atta.szlcsc.com/upload/public/pdf/source/20200820/C84270_26D056BA53480CD9796A84C2EB45318C.pdf; Supplier: LCSC; Emitted Color: 红色; Forward Voltage (VF): 1.6V~2.6V; Power Dissipation: 65mW; Forward Current: 20mA; Dominant Wavelength: 615nm~630nm; Lens Color: 无色透明透镜; Luminous Intensity: 67mcd~195mcd; Viewing Angle: 130°; Operating Temperature: -30℃~+85℃
Slot = ER10BGFBK: 连接器类型:EDGE SLOT;间距:2.54mm;引脚总数:10P;安装方式:弯插;工作温度范围:-55℃~+125℃;; LCSC Part Name: 2.54mm P数:10P; Supplier Part: C5173327; Manufacturer: WingTAT(格林柏); Supplier Footprint: 弯插,P=2.54mm; JLCPCB Part Class: Extended Part; Datasheet: https://atta.szlcsc.com/upload/public/pdf/source/20220923/933BB8F85CA443BD8EE6C14887750DBD.pdf; Supplier: LCSC; Connector Type: EDGE SLOT; Pitch: 2.54mm; Number of Pins: 10P; Mounting Style: 弯插; Height Above Board: 9.25mm; Contact Material: 铜合金; Contact Plating: 金; Operating Temperature Range: -55℃~+125℃
STLink = PZ254V-11-04P: 插针结构:1x4P;间距:2.54mm;行距:-;圆针/方针:方针;安装类型:直插;排数:单排;总PIN位数:4P;额定电流:3A;额定电压:250V;配合针长度:6mm;塑高:2.5mm;端接针长度:3mm;触头材质:-;工作温度范围:-40℃~+105℃;颜色:黑色;; LCSC Part Name: 间距:2.54mm 1x4P 直插 方针; Supplier Part: C2691448; Manufacturer: XFCN(兴飞); Supplier Footprint: 插件,P=2.54mm; JLCPCB Part Class: 扩展库; Datasheet: https://atta.szlcsc.com/upload/public/pdf/source/20200309/C492403_F9F19131791D08044AD4F84F8E751A34.pdf; Supplier: LCSC; Pin Structure: 1x4P; Pitch: 2.54mm; Circluar Pins/Square Pins: 方针; Mounting Type: 直插; Number of Rows: 单排; Number of Pins: 4P; Current Rating (Max): 3A; Voltage Rating (Max): 250V; Length of Mating Pin: 6mm; Insulation Height: 2.5mm; Length of End Connection Pin: 3mm; Operating Temperature Range: -40℃~+105℃; Color: 黑色
SW1 = TA-3522-A3: LCSC Part Name: 滑动开关9.1*3.5*4.0mm插件侧拨三脚二档; Supplier Part: C514011; Manufacturer: Yuandi(元迪); Supplier Footprint: 插件-3P,3.5x9.1mm,弯插; JLCPCB Part Class: 扩展库; Datasheet: https://atta.szlcsc.com/upload/public/pdf/source/20200415/C514009_6EED03F5D6F9885D6506BA57997A5078.pdf; Supplier: LCSC
TP4056 = TP4056-42-ESOP8: 锂电池充电芯片 42代表电池满电电压4.2V。; Supplier Part: C16581; Manufacturer: TOPPOWER(南京拓微); Supplier Footprint: ESOP-8; JLCPCB Part Class: 扩展库; Datasheet: https://atta.szlcsc.com/upload/public/pdf/source/20190626/C16581_611BCF5D7CF554EAE465137A8F68DB3E.pdf; Supplier: LCSC
U1 = STM32F103CBT6: CPU内核:ARM-M3;程序存储容量:128KB;RAM总容量:20KB;GPIO端口数量:37;工作电压范围:2V~3.6V;CPU最大主频:72MHz;程序存储器类型:FLASH;; LCSC Part Name: 主流增强型ARM Cortex-M3 MCU，具有128 KB Flash、72 MHz CPU、电机控制、USB和CAN; Supplier Part: C8304; Manufacturer: ST(意法半导体); Supplier Footprint: LQFP-48(7x7); JLCPCB Part Class: Extended Part; Datasheet: https://atta.szlcsc.com/upload/public/pdf/source/20150811/1457707344439.pdf; Supplier: LCSC; CPU Core: ARM-M3; Program Storage Size: 128KB; RAM Size: 20KB; GPIO Ports Number: 37; Operating Voltage Range: 2V~3.6V; CPU Maximum Speed: 72MHz; Program Memory Type: FLASH; Operating Temperature Range: -40℃~+85℃; ADC (Bit): 12bit; Universal Serial Bus: 有; Peripheral/Function: DMA；温度传感器；PWM; Watchdog: 有; Infrared Data Association: 有; Low-Voltage Detect: 有; Direct Memory Access: 有; Internal Oscillator: 有; 16Bit Timer: 3; CAN: 1; UART/USART: 3; I2C: 2; SPI: 3
U2 = CH340N: LCSC Part Name: USB转串口芯片 CH340; Supplier Part: C2977777; Manufacturer: WCH(南京沁恒); Supplier Footprint: SOP-8; JLCPCB Part Class: 扩展库; Datasheet: https://atta.szlcsc.com/upload/public/pdf/source/20230530/6E401E9554E9F5311886CC8B3F89B62E.pdf; Supplier: LCSC
U3 = W25Q16JVSSIQ_C131025: （与C82317为同一颗物料，只是编带方式不一样。）3V 16Mbit Serial Flash Memory with dual/quad SPI; Supplier Part: C131025; Manufacturer: WINBOND(华邦); Supplier Footprint: SOIC-8-208mil; JLCPCB Part Class: 扩展库; Datasheet: https://atta.szlcsc.com/upload/public/pdf/source/20210318/C131025_490139441AABAB3970D06D5A0D9163A5.pdf; Supplier: LCSC
U4 = MPU-6050: 传感器类型:加速度计陀螺仪;; Supplier Part: C24112; Manufacturer: TDK InvenSense(应美盛); Supplier Footprint: QFN-24-EP(4x4); JLCPCB Part Class: 扩展库; Datasheet: https://atta.szlcsc.com/upload/public/pdf/source/20140425/1457707046159.pdf; Supplier: LCSC; Sensor Type: 加速度计陀螺仪; Operating Temperature: -40℃~+85℃
USB1 = TYPE-C 16PIN 2MD(073): 连接器类型:Type-C;标准:-;公母:母;端口数量:1;触点数量:16P;安装方式:卧贴;额定电流 - 电源:5A;工作温度范围:-25℃~+85℃;; LCSC Part Name: Type-C 母 卧贴; Supplier Part: C2765186; Manufacturer: SHOU HAN(首韩); Supplier Footprint: SMD; JLCPCB Part Class: Extended Part; Datasheet: https://atta.szlcsc.com/upload/public/pdf/source/20211123/39B17C16241EAC15C5E277BDA434118E.pdf; Supplier: LCSC; Connector Type: Type-C; Gender: 母; Number of Ports: 1; Number of Contacts: 16P; Mounting Style: 卧贴; Current Rating - Power (Max): 5A; Operating Temperature Range: -25℃~+85℃
X1 = X32258MOB4SI: 晶振类型:贴片晶振;频率:8MHz;常温频差:±10ppm;外接负载电容:12pF;频率稳定度(全温):±20ppm;; LCSC Part Name: 8MHz ±10ppm 12pF; Supplier Part: C2682775; Manufacturer: YXC(扬兴晶振); Supplier Footprint: SMD3225-4P; JLCPCB Part Class: 扩展库; Datasheet: https://atta.szlcsc.com/upload/public/pdf/source/20240329/19D5F850207469550BEB00D7DFEDBC7A.pdf; Supplier: LCSC; Crystal Type: 贴片晶振; Normal temperature Frequency Tolerance: ±10ppm; External load capacitor: 12pF; Frequency Stability(Full temperature range): ±20ppm; Equivalent Series Resistance (ESR): 150Ω; Operating Temperature: -40℃~+85℃

## Nets
3V3: BOOT0.2 C6.1 C8.1 C9.1 C10.1 C11.1 C16.1 C20.1 C22.1 L2.2 LED3.2(A) R7.1 R8.1 R11.1 RT9013.5(VOUT) Slot.1 STLink.1 U1.24(VDD_1) U1.36(VDD_2) U1.48(VDD_3) U2.5(VCC) U3.8(VCC) U4.8(VLOGIC) U4.13(VDD)
GND: BAT1.2 C1.2 C2.2 C3.2 C4.2 C5.2 C6.2 C7.2 C8.2 C9.2 C10.2 C11.2 C12.2 C13.1 C14.1 C15.1 C16.2 C17.2 C18.2 C19.2 C20.2 C21.2 C22.2 Control.1 Control.2 Control.3 PROG0.1 R1.1 R4.2 R6.1 R10.2 R12.1 RST0.2 RT6150.3(GND) RT6150.9(GND) RT6150.11(EXP) RT9013.2(GND) Signal.2(K) Slot.2 STLink.2 TP4056.1(TEMP) TP4056.3(GND) TP4056.9(EP) U1.8(VSSA) U1.23(VSS_1) U1.35(VSS_2) U1.47(VSS_3) U2.3(GND) U3.4(GND) U4.1(CLKIN) U4.9(AD0) U4.11(FSYNC) U4.18(GND) USB1.1(GND) USB1.12(GND) USB1.13(SHELL) USB1.14(SHELL) X1.2(GND) X1.4(GND)
VBAT_E: C18.1 U1.1(VBAT)
VCC_USB: C1.1 D2.1(A) LED1.2(A) LED2.2(A) Q1.1(G) R4.1 TP4056.4(VCC) TP4056.8(CE) USB1.2(VBUS) USB1.11(VBUS)
BOOT0: BOOT0.1 R12.2 U1.44(BOOT0)
D+: U2.1(UD+) USB1.6(DP1) USB1.8(DP2)
D-: U2.2(UD-) USB1.5(DN2) USB1.7(DN1)
NRST: C17.1 R11.2 RST0.1 U1.7(NRST)
OSC_IN: C13.2 U1.5(PD0-OSC_IN) X1.1
OSC_OUT: C14.2 U1.6(PD1-OSC_OUT) X1.3
PA0: C19.1 Control.4 U1.10(PA0-WKUP)
PA1_LED: R9.1 U1.11(PA1)
PA2: U1.12(PA2)
PA3: U1.13(PA3)
PA4_CSS: Slot.3 U1.14(PA4)
PA5_SCK: Slot.4 U1.15(PA5)
PA6_MISO: Slot.5 U1.16(PA6)
PA7_MOSI: Slot.6 U1.17(PA7)
PA13_DIO: STLink.4 U1.34(PA13)
PA14_CLK: STLink.3 U1.37(PA14)
PB0_CUS: Slot.10 U1.18(PB0)
PB1_ADC: Slot.8 U1.19(PB1)
PB5_INT1: U1.41(PB5) U4.12(INT)
PB6_SCL: R8.2 U1.42(PB6) U4.23(SCL)
PB7_SDA: R7.2 U1.43(PB7) U4.24(SDA)
PB10_SCL_TX: Slot.7 U1.21(PB10)
PB11_SDA_RX: Slot.9 U1.22(PB11)
RXD: U1.30(PA9) U2.7(RXD)
SPI2_CS: U1.25(PB12) U3.1(/CS)
SPI2_MISO: U1.27(PB14) U3.2(DO/IO1)
SPI2_MOSI: U1.28(PB15) U3.5(DI/IO0)
SPI2_SCK: U1.26(PB13) U3.6(CLK)
TXD: U1.31(PA10) U2.6(TXD)
$1N1926: L1.2 RT6150.2(LX2)
$1N2095: R5.1 R6.2 RT6150.10(FB)
$1N5022: C7.1 U2.8(V3)
$1N9764: R1.2 USB1.4(CC1) USB1.10(CC2)
$1N10379: LED2.1(K) R3.2
$1N10382: LED1.1(K) R2.2
$1N10530: R3.1 TP4056.7(CHRG#)
$1N10534: R2.1 TP4056.6(STDBY#)
$1N10716: PROG0.2 TP4056.2(PROG)
$1N11756: BAT1.1 C2.1 Q1.3(D) TP4056.5(BAT)
$1N13991: C12.1 L2.1 U1.9(VDDA)
$1N14717: R9.2 Signal.1(A)
$1N14914: LED3.1(K) R10.1
$1N21597: L1.1 RT6150.4(LX1)
$1N22177: D2.2(K) Q1.2(S) SW1.2
$1N22183: C3.1 RT6150.5(VIN) RT6150.6(EN) RT6150.7(PS) RT6150.8(VINA) SW1.1
$1N34559: C15.2 U4.10(REGOUT)
$1N43151: C21.1 U4.20(CPOUT)
$1N53472: C4.1 C5.1 R5.2 RT6150.1(VOUT) RT9013.1(VIN) RT9013.3(EN)

Not connected (* = marked no-connect by the designer): RT9013 4(NC)*; SW1 3*; U1 2(PC13-TAMPER-RTC)* 3(PC14-OSC32_IN)* 4(PC15-OSC32_OUT)* 20(PB2)* 29(PA8)* 32(PA11)* 33(PA12)* 38(PA15)* 39(PB3)* 40(PB4)* 45(PB8)* 46(PB9)*; U2 4(RTS#)*; U3 3(IO2)* 7(IO3)*; U4 2(NC)* 3(NC)* 4(NC)* 5(NC)* 6(AUX_DA)* 7(AUX_CL)* 14(NC)* 15(NC)* 16(NC)* 17(NC)* 19(RESV)* 21(RESV)* 22(RESV)* 25(EP)*; USB1 3(SBU2)* 9(SBU1)*

## Notes on the sheet
- User_Button
- Reset_Button
- User_LED
- MPU6050
- BOOT0_Button
- Power_LED
- SWD
- 8Mhz
- STM32F103C8T6
- Slot
- Charger IC
- Power source selector
- 4.2V Li-ion in _ 3.3V DC out
- Type-C charge and serial

# Schematic Module10_Schematic
Board Name: Module10; Create Date: 2024-08-22; Page Name: P1; Project Name: 赛博魔杖_STM32卷积神经网络; Schematic Name: Module10_Schematic; Update Date: 2024-08-22
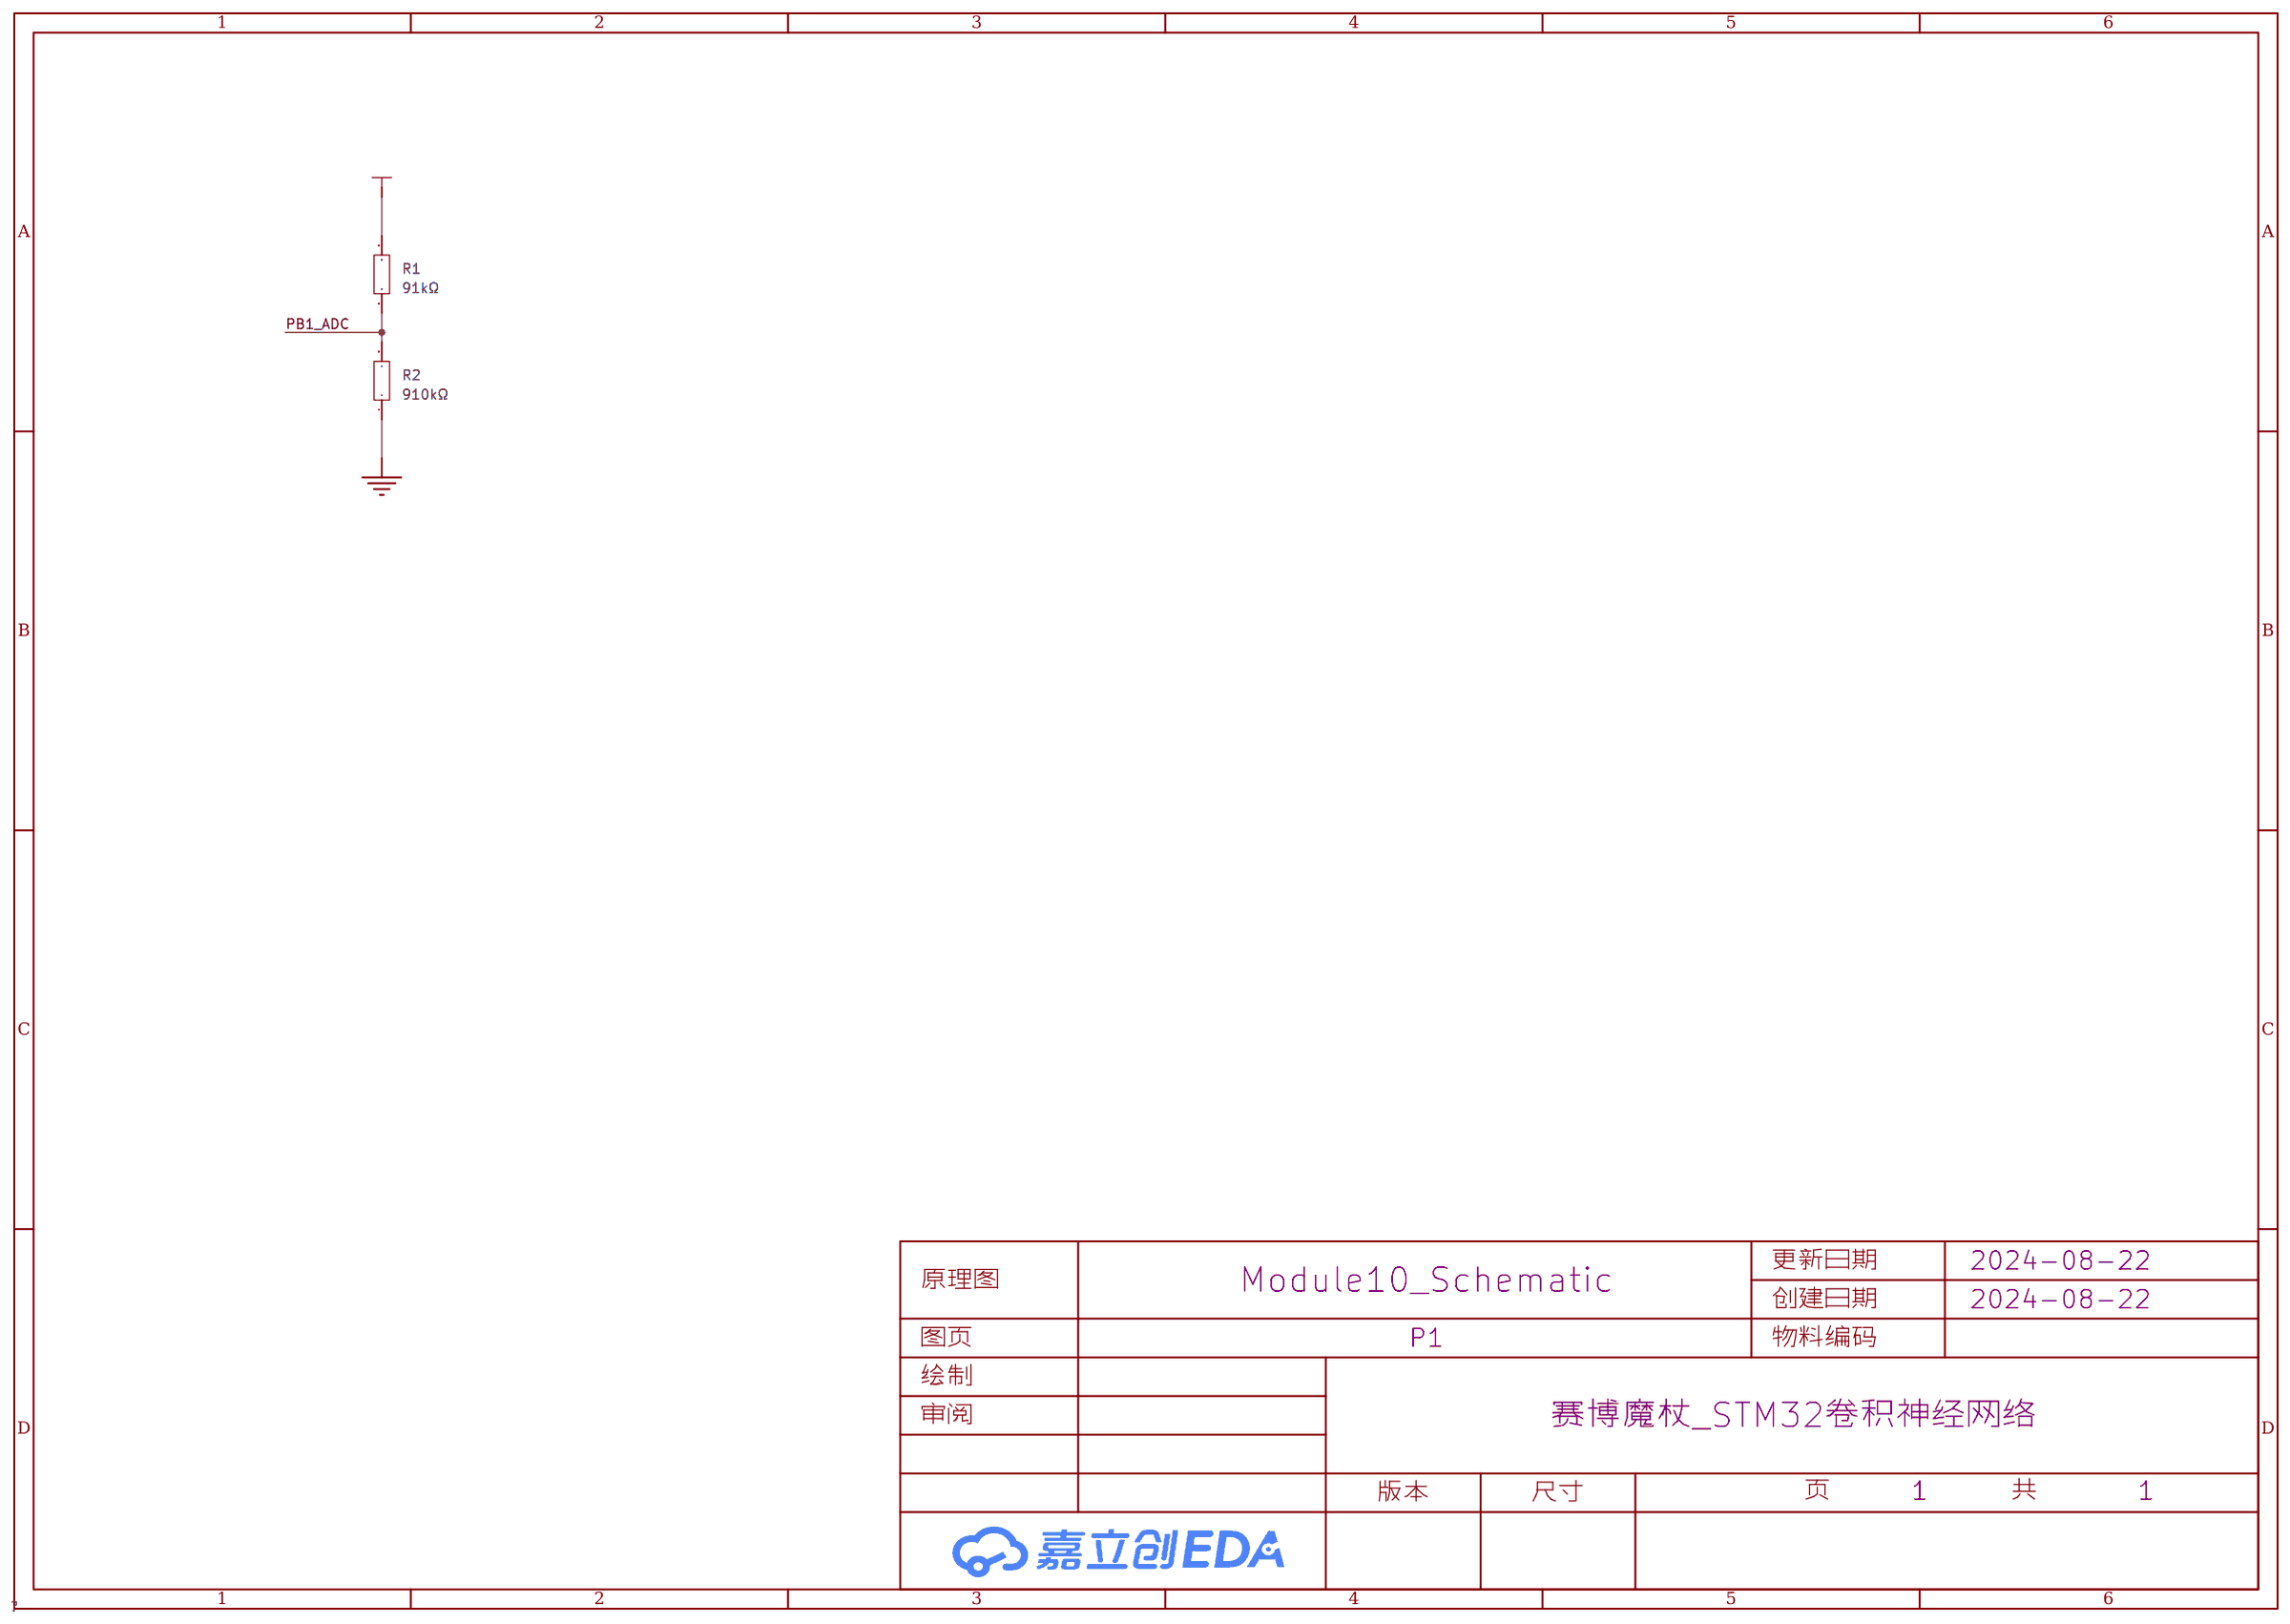
[diagram p3: schematic sheet]

## Parts
R1  91kΩ  [R0603]
R2  910kΩ  [R0603]

## Library data of the parts
R1 R2 = 0603WAF9103T5E: 电阻类型:厚膜电阻;阻值:910kΩ;精度:±1%;功率:100mW;最大工作电压:75V;温度系数:±100ppm/℃;; LCSC Part Name: 910kΩ ±1% 100mW 厚膜电阻; Supplier Part: C23263; Manufacturer: UNI-ROYAL(厚声); Supplier Footprint: 0603; JLCPCB Part Class: 扩展库; Datasheet: https://atta.szlcsc.com/upload/public/pdf/source/20200306/C422600_1E6D84923E4A46A82E41ADD87F860B5C.pdf; Supplier: LCSC; Type: 厚膜电阻; Tolerance: ±1%; Power(Watts): 100mW; Overload Voltage (Max): 75V; Temperature Coefficient: ±100ppm/℃; Operating Temperature Range: -55℃~+155℃

## Nets
3V3: R1.1
GND: R2.1
PB1_ADC: R1.2 R2.2

# Schematic Module4_Schematic
Board Name: Module4; Create Date: 2024-08-22; Page Name: P1; Project Name: 赛博魔杖_STM32卷积神经网络; Schematic Name: Module4_Schematic; Update Date: 2024-08-22
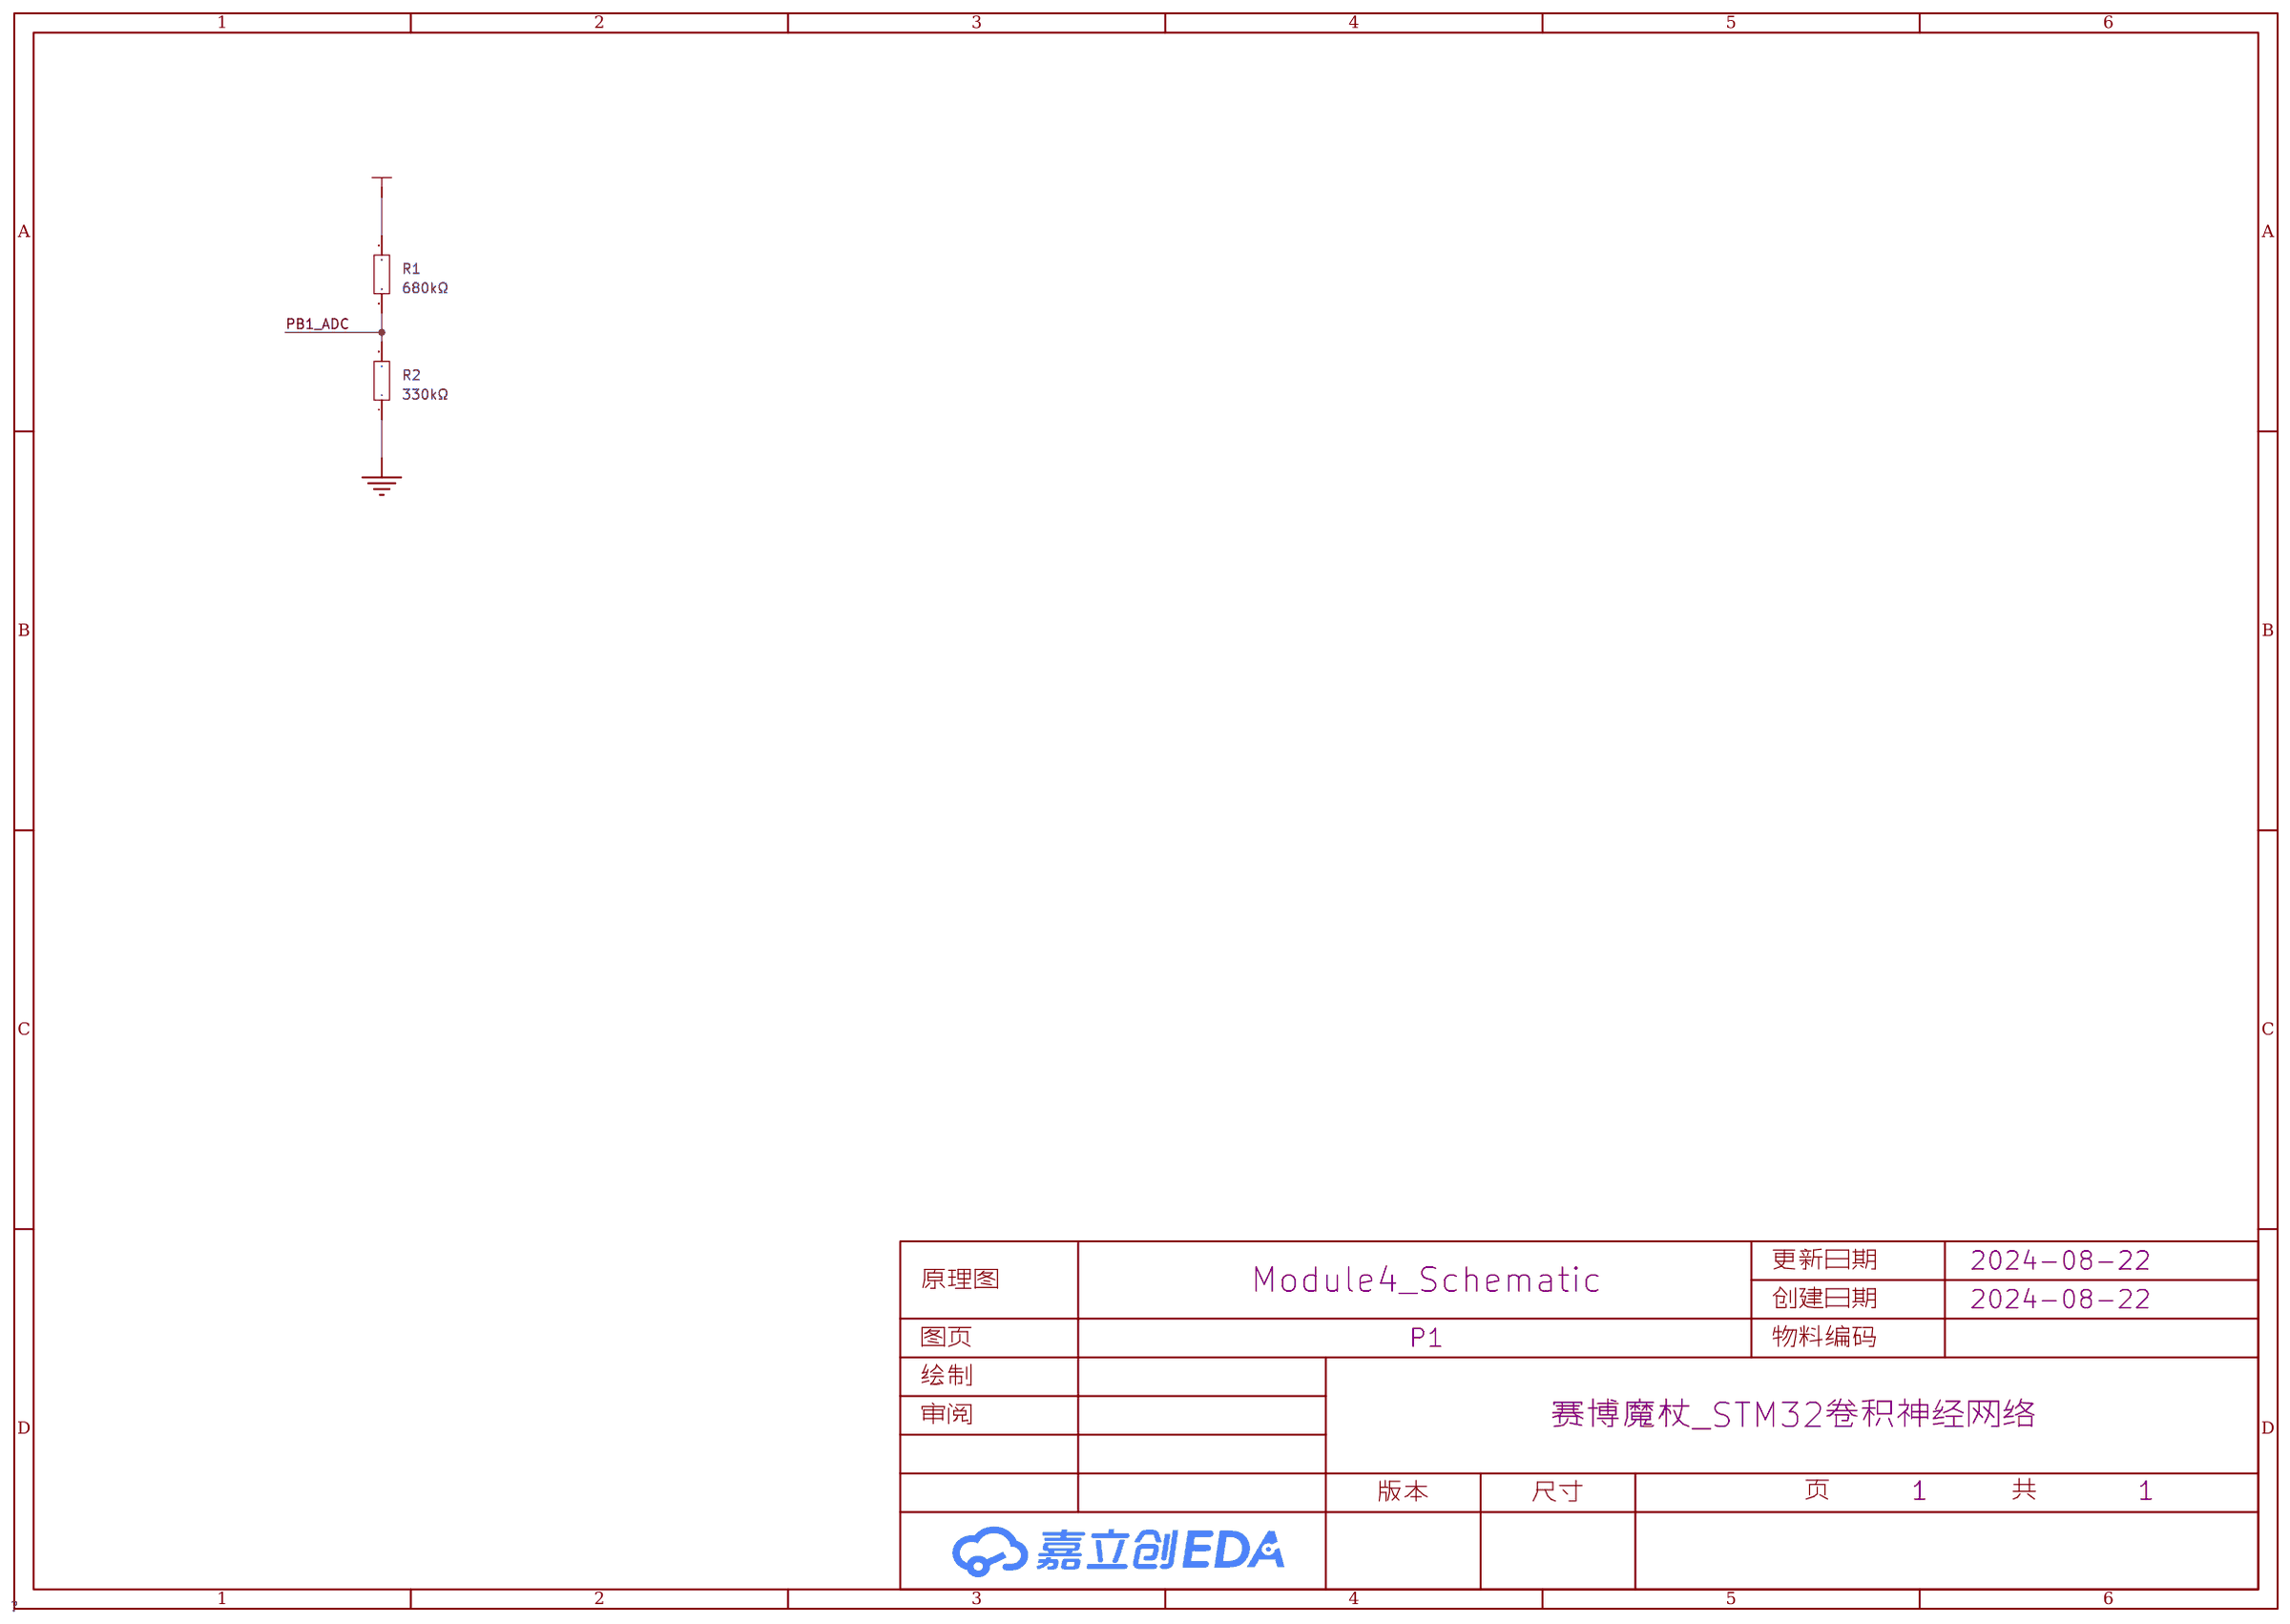
[diagram p4: schematic sheet]

## Parts
R1  680kΩ  [R0603]
R2  330kΩ  [R0603]

## Library data of the parts
R1 R2 = 0603WAF9103T5E: 电阻类型:厚膜电阻;阻值:910kΩ;精度:±1%;功率:100mW;最大工作电压:75V;温度系数:±100ppm/℃;; LCSC Part Name: 910kΩ ±1% 100mW 厚膜电阻; Supplier Part: C23263; Manufacturer: UNI-ROYAL(厚声); Supplier Footprint: 0603; JLCPCB Part Class: 扩展库; Datasheet: https://atta.szlcsc.com/upload/public/pdf/source/20200306/C422600_1E6D84923E4A46A82E41ADD87F860B5C.pdf; Supplier: LCSC; Type: 厚膜电阻; Tolerance: ±1%; Power(Watts): 100mW; Overload Voltage (Max): 75V; Temperature Coefficient: ±100ppm/℃; Operating Temperature Range: -55℃~+155℃

## Nets
3V3: R1.1
GND: R2.1
PB1_ADC: R1.2 R2.2

# Schematic Module5_Schematic
Board Name: Module5; Create Date: 2024-08-22; Page Name: P1; Project Name: 赛博魔杖_STM32卷积神经网络; Schematic Name: Module5_Schematic; Update Date: 2024-08-22
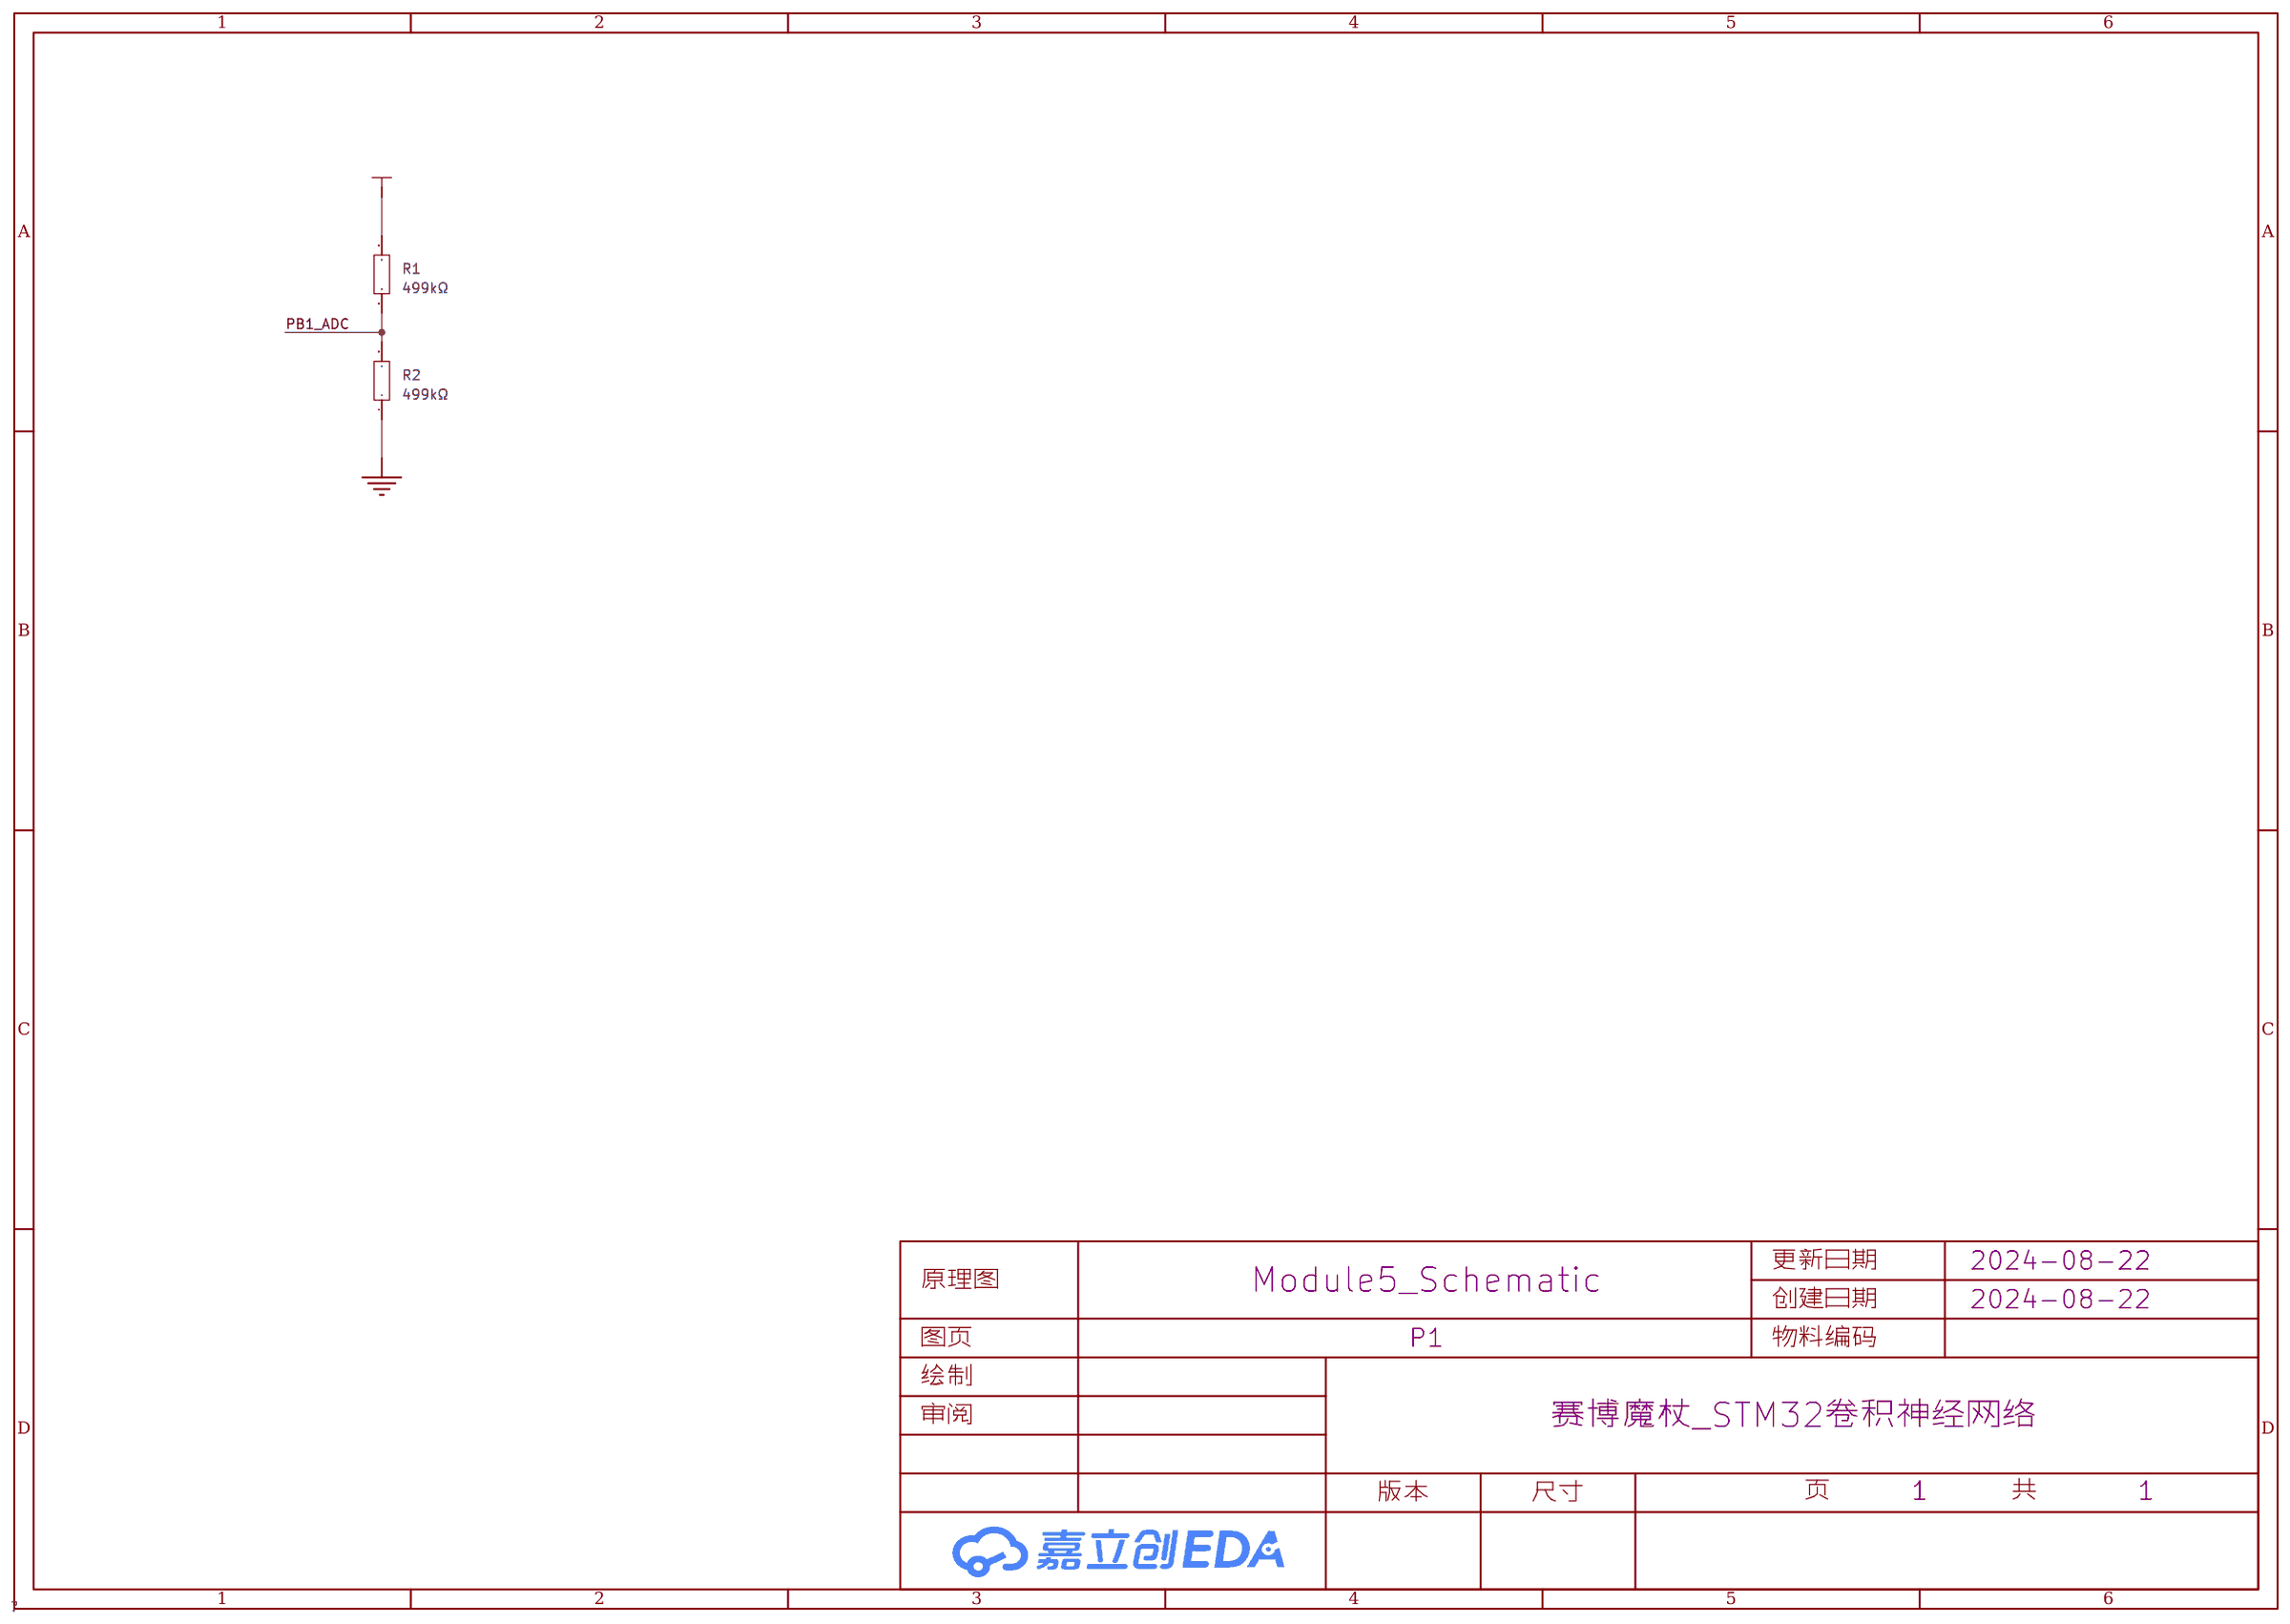
[diagram p5: schematic sheet]

## Parts
R1  499kΩ  [R0603]
R2  499kΩ  [R0603]

## Library data of the parts
R1 R2 = 0603WAF9103T5E: 电阻类型:厚膜电阻;阻值:910kΩ;精度:±1%;功率:100mW;最大工作电压:75V;温度系数:±100ppm/℃;; LCSC Part Name: 910kΩ ±1% 100mW 厚膜电阻; Supplier Part: C23263; Manufacturer: UNI-ROYAL(厚声); Supplier Footprint: 0603; JLCPCB Part Class: 扩展库; Datasheet: https://atta.szlcsc.com/upload/public/pdf/source/20200306/C422600_1E6D84923E4A46A82E41ADD87F860B5C.pdf; Supplier: LCSC; Type: 厚膜电阻; Tolerance: ±1%; Power(Watts): 100mW; Overload Voltage (Max): 75V; Temperature Coefficient: ±100ppm/℃; Operating Temperature Range: -55℃~+155℃

## Nets
3V3: R1.1
GND: R2.1
PB1_ADC: R1.2 R2.2

# Schematic Module6_Schematic
Board Name: Module6; Create Date: 2024-08-22; Page Name: P1; Project Name: 赛博魔杖_STM32卷积神经网络; Schematic Name: Module6_Schematic; Update Date: 2024-08-22
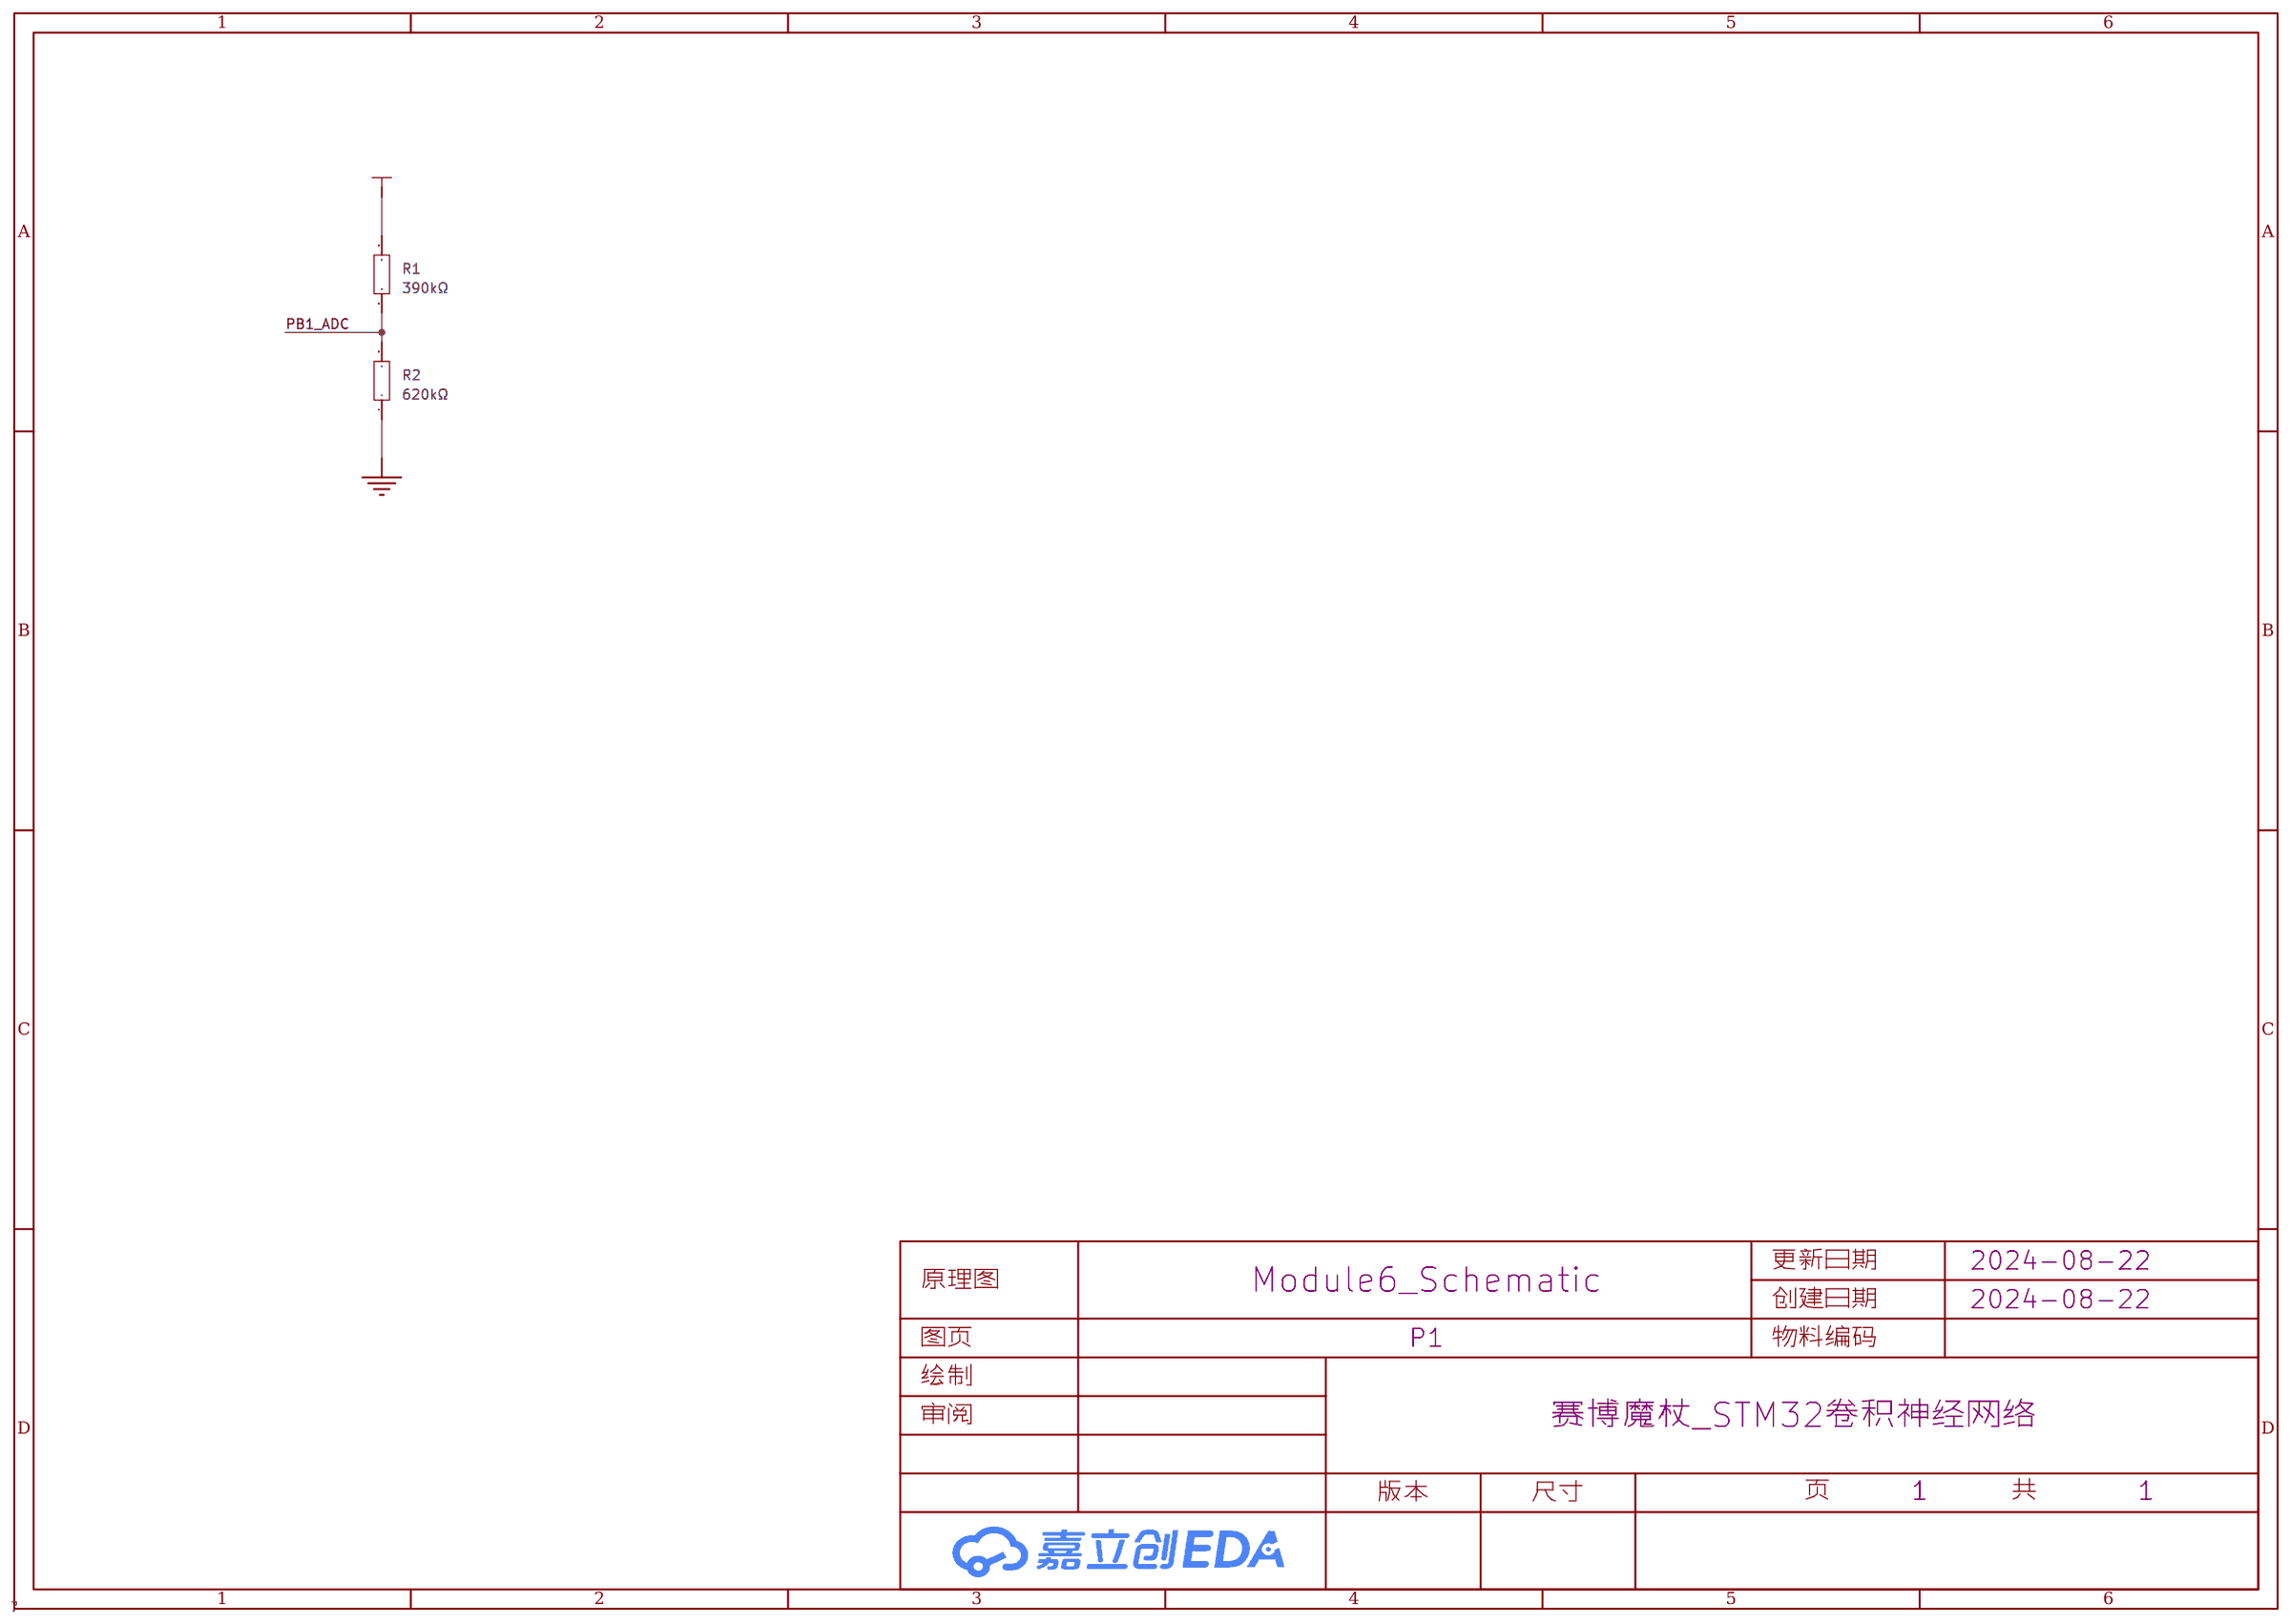
[diagram p6: schematic sheet]

## Parts
R1  390kΩ  [R0603]
R2  620kΩ  [R0603]

## Library data of the parts
R1 R2 = 0603WAF9103T5E: 电阻类型:厚膜电阻;阻值:910kΩ;精度:±1%;功率:100mW;最大工作电压:75V;温度系数:±100ppm/℃;; LCSC Part Name: 910kΩ ±1% 100mW 厚膜电阻; Supplier Part: C23263; Manufacturer: UNI-ROYAL(厚声); Supplier Footprint: 0603; JLCPCB Part Class: 扩展库; Datasheet: https://atta.szlcsc.com/upload/public/pdf/source/20200306/C422600_1E6D84923E4A46A82E41ADD87F860B5C.pdf; Supplier: LCSC; Type: 厚膜电阻; Tolerance: ±1%; Power(Watts): 100mW; Overload Voltage (Max): 75V; Temperature Coefficient: ±100ppm/℃; Operating Temperature Range: -55℃~+155℃

## Nets
3V3: R1.1
GND: R2.1
PB1_ADC: R1.2 R2.2

# Schematic Module7_Schematic
Board Name: Module7; Create Date: 2024-08-22; Page Name: P1; Project Name: 赛博魔杖_STM32卷积神经网络; Schematic Name: Module7_Schematic; Update Date: 2024-08-22
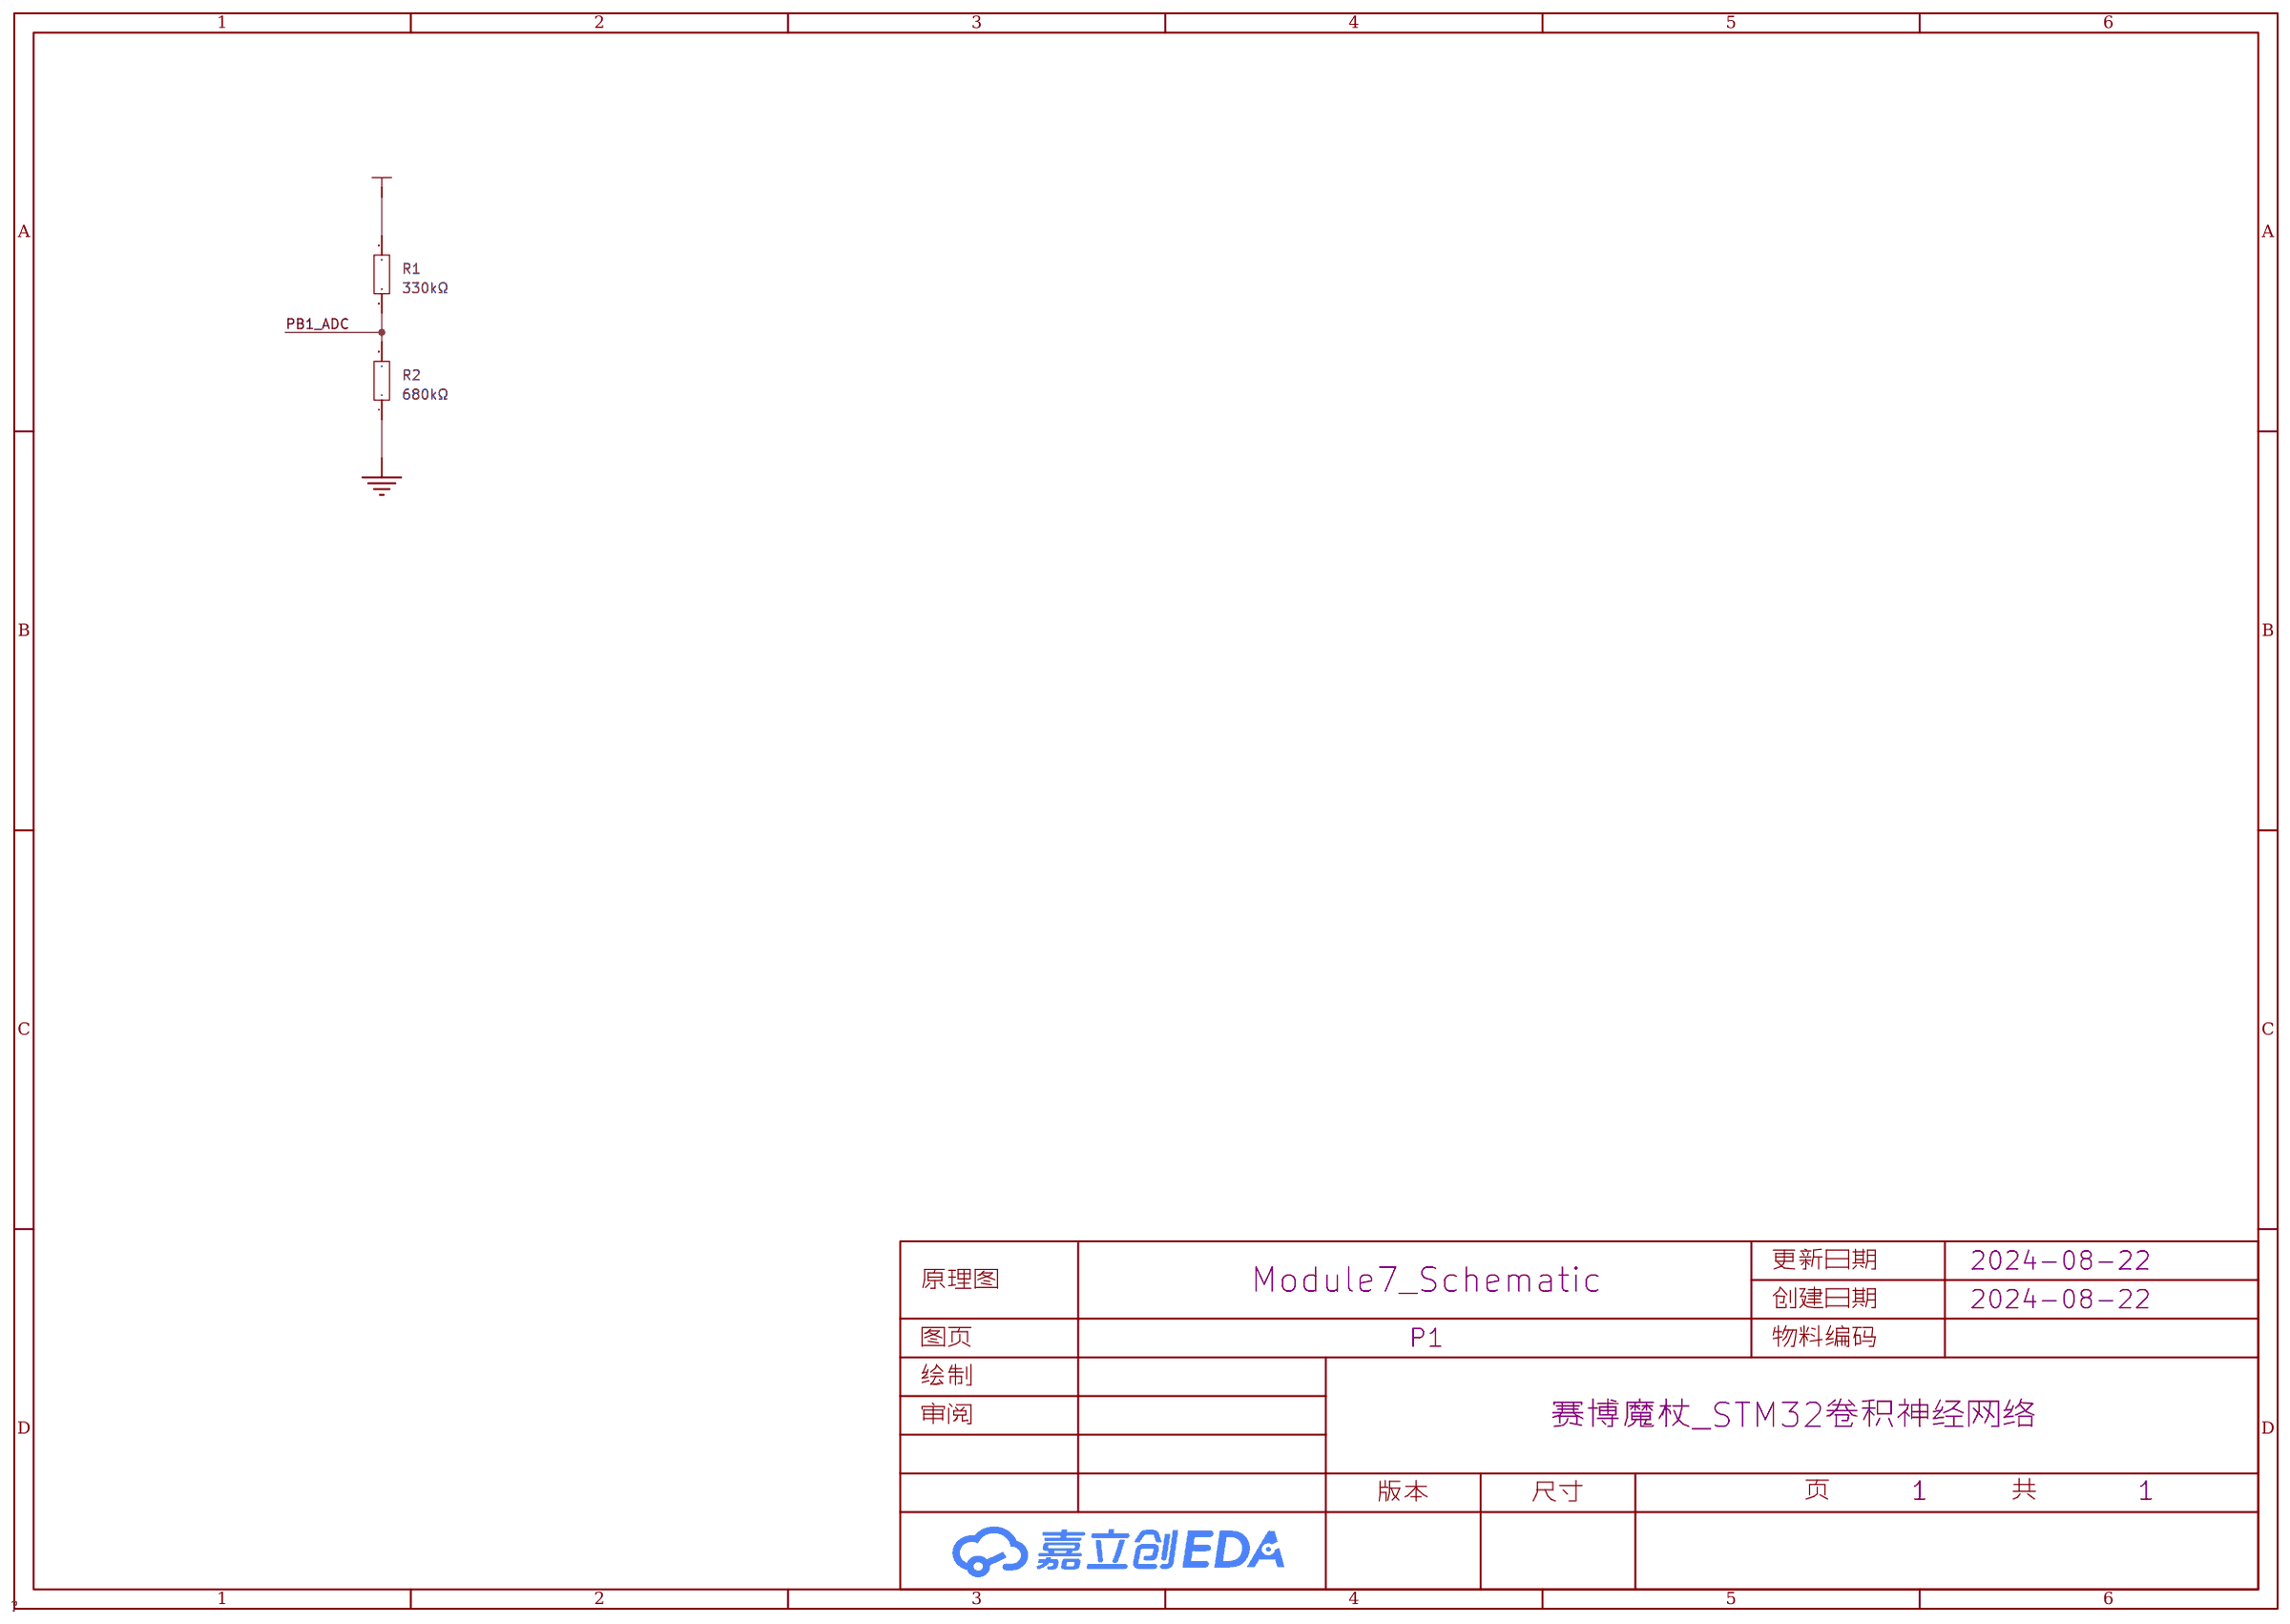
[diagram p7: schematic sheet]

## Parts
R1  330kΩ  [R0603]
R2  680kΩ  [R0603]

## Library data of the parts
R1 R2 = 0603WAF9103T5E: 电阻类型:厚膜电阻;阻值:910kΩ;精度:±1%;功率:100mW;最大工作电压:75V;温度系数:±100ppm/℃;; LCSC Part Name: 910kΩ ±1% 100mW 厚膜电阻; Supplier Part: C23263; Manufacturer: UNI-ROYAL(厚声); Supplier Footprint: 0603; JLCPCB Part Class: 扩展库; Datasheet: https://atta.szlcsc.com/upload/public/pdf/source/20200306/C422600_1E6D84923E4A46A82E41ADD87F860B5C.pdf; Supplier: LCSC; Type: 厚膜电阻; Tolerance: ±1%; Power(Watts): 100mW; Overload Voltage (Max): 75V; Temperature Coefficient: ±100ppm/℃; Operating Temperature Range: -55℃~+155℃

## Nets
3V3: R1.1
GND: R2.1
PB1_ADC: R1.2 R2.2

# Schematic Module8_Schematic
Board Name: Module8; Create Date: 2024-08-22; Page Name: P1; Project Name: 赛博魔杖_STM32卷积神经网络; Schematic Name: Module8_Schematic; Update Date: 2024-08-22
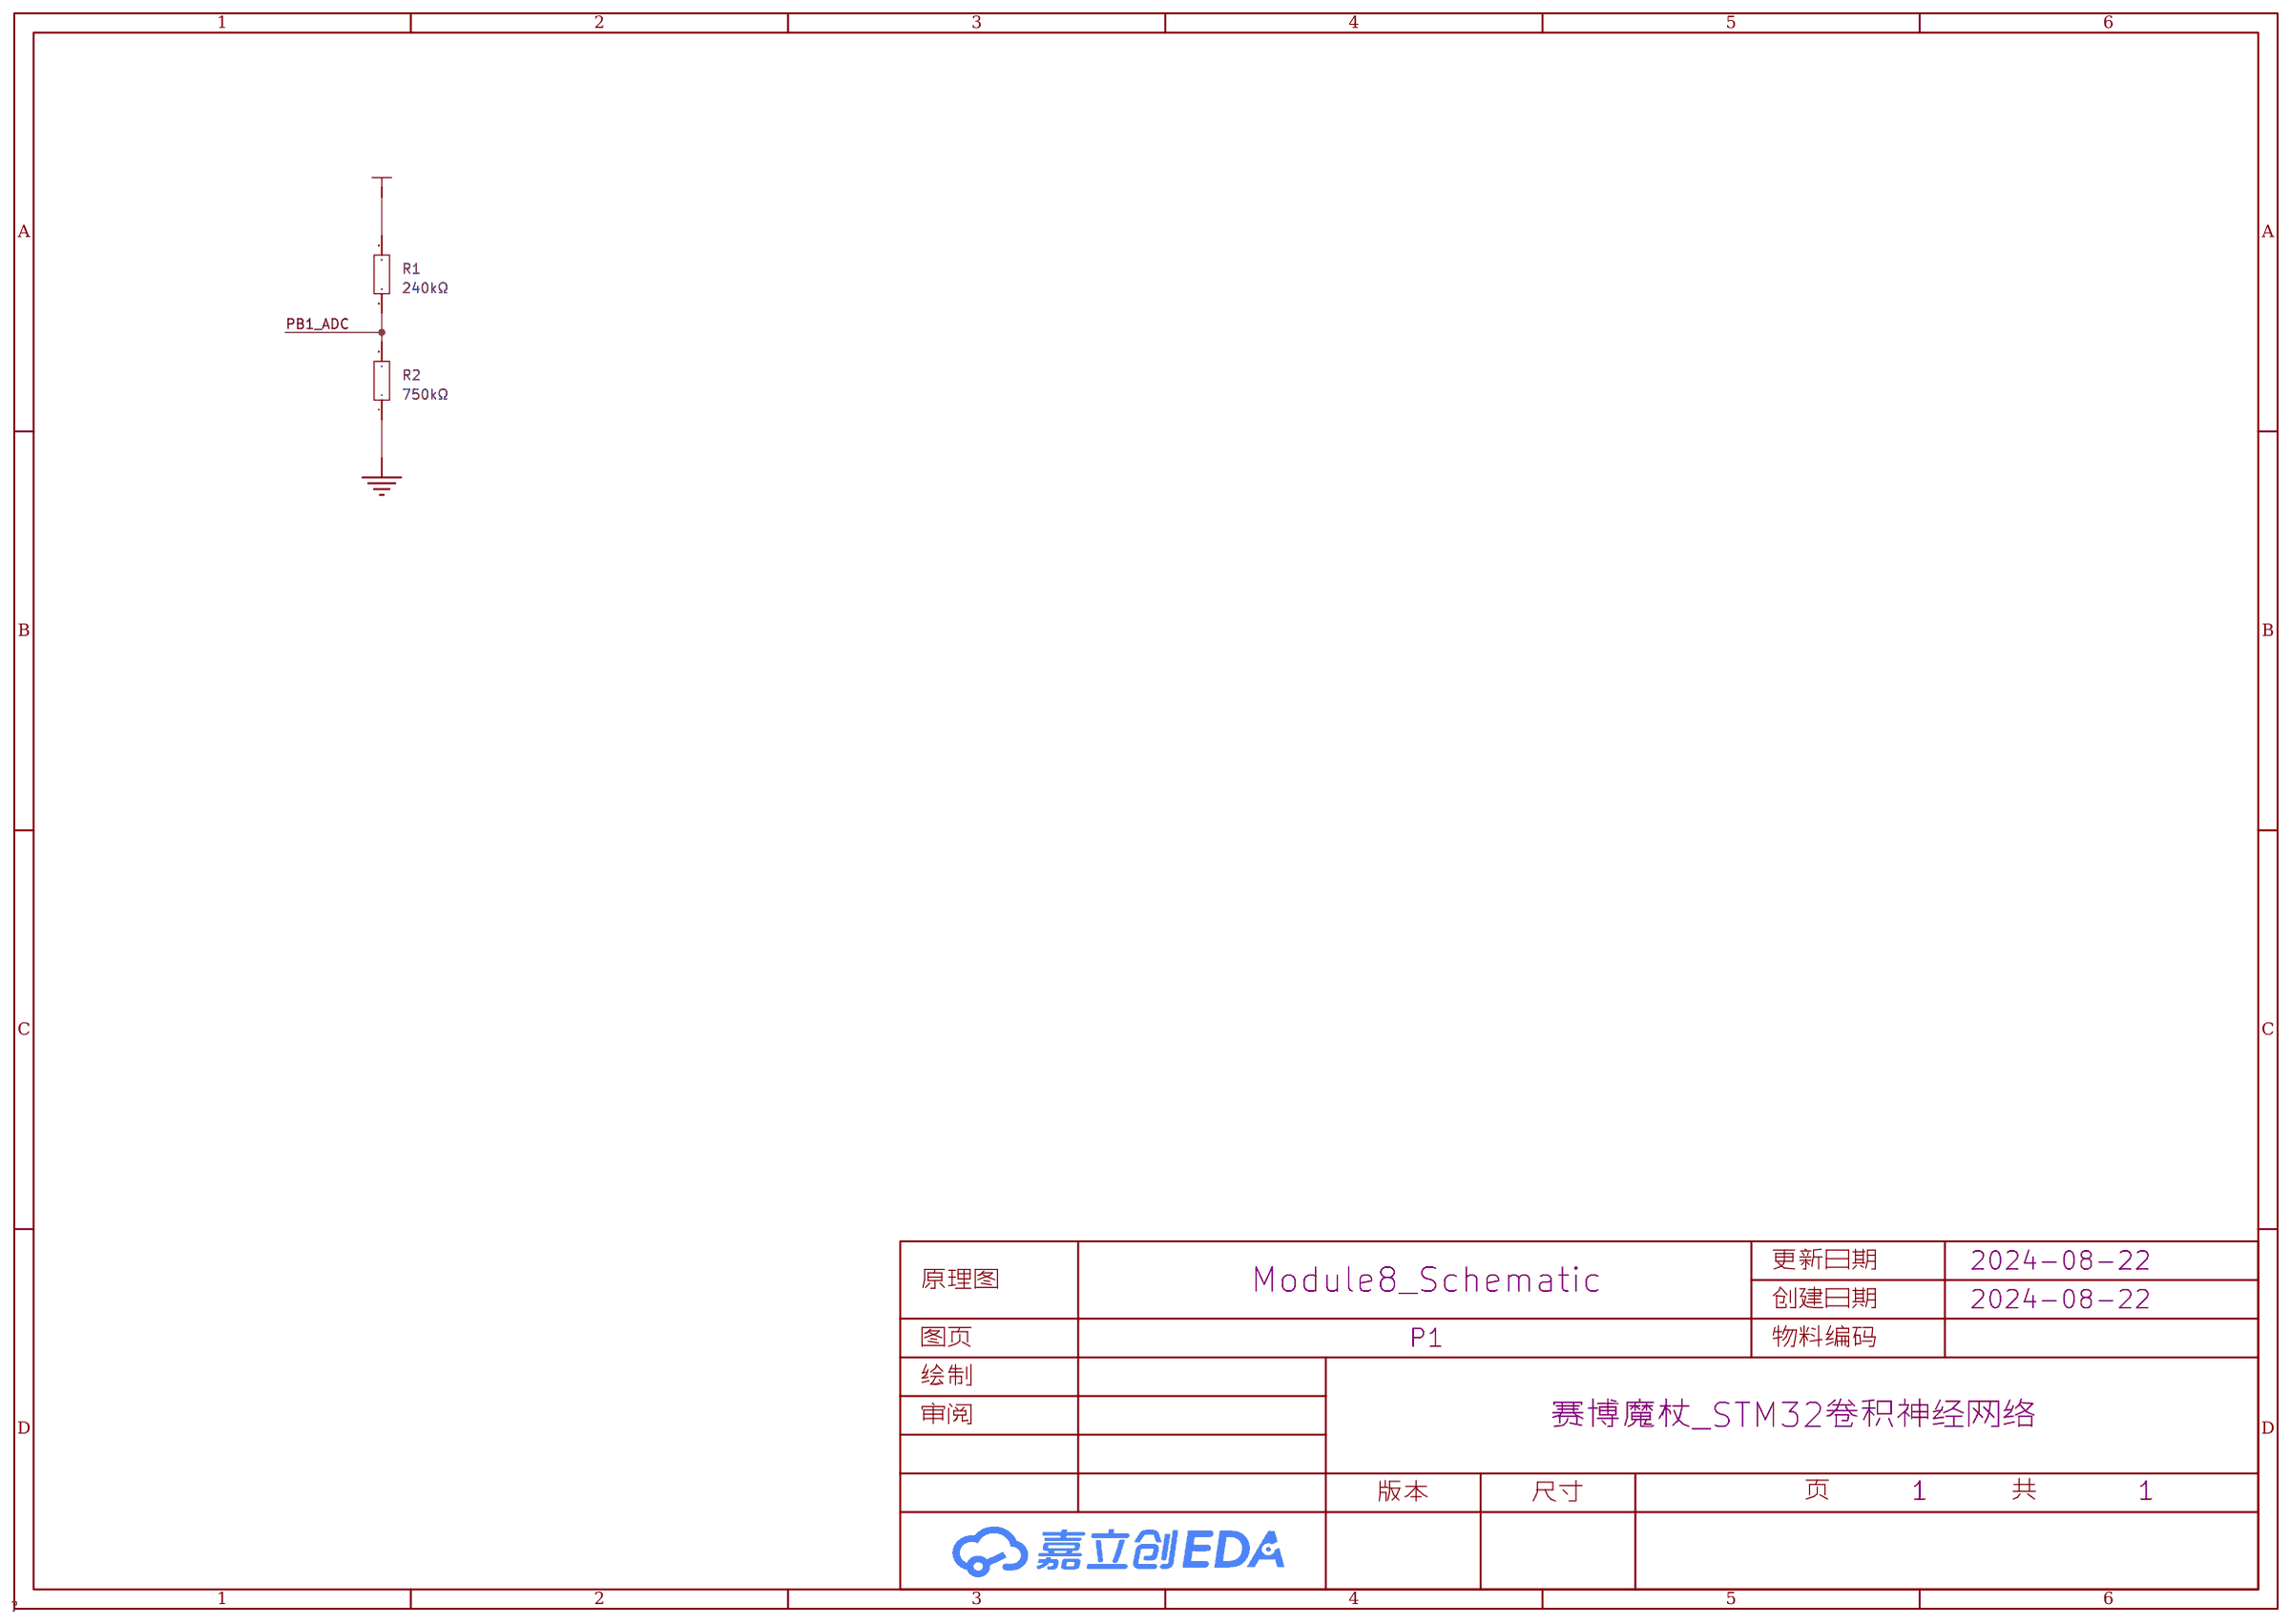
[diagram p8: schematic sheet]

## Parts
R1  240kΩ  [R0603]
R2  750kΩ  [R0603]

## Library data of the parts
R1 R2 = 0603WAF9103T5E: 电阻类型:厚膜电阻;阻值:910kΩ;精度:±1%;功率:100mW;最大工作电压:75V;温度系数:±100ppm/℃;; LCSC Part Name: 910kΩ ±1% 100mW 厚膜电阻; Supplier Part: C23263; Manufacturer: UNI-ROYAL(厚声); Supplier Footprint: 0603; JLCPCB Part Class: 扩展库; Datasheet: https://atta.szlcsc.com/upload/public/pdf/source/20200306/C422600_1E6D84923E4A46A82E41ADD87F860B5C.pdf; Supplier: LCSC; Type: 厚膜电阻; Tolerance: ±1%; Power(Watts): 100mW; Overload Voltage (Max): 75V; Temperature Coefficient: ±100ppm/℃; Operating Temperature Range: -55℃~+155℃

## Nets
3V3: R1.1
GND: R2.1
PB1_ADC: R1.2 R2.2

# Schematic Module9_Schematic
Board Name: Module9; Create Date: 2024-08-22; Page Name: P1; Project Name: 赛博魔杖_STM32卷积神经网络; Schematic Name: Module9_Schematic; Update Date: 2024-08-22
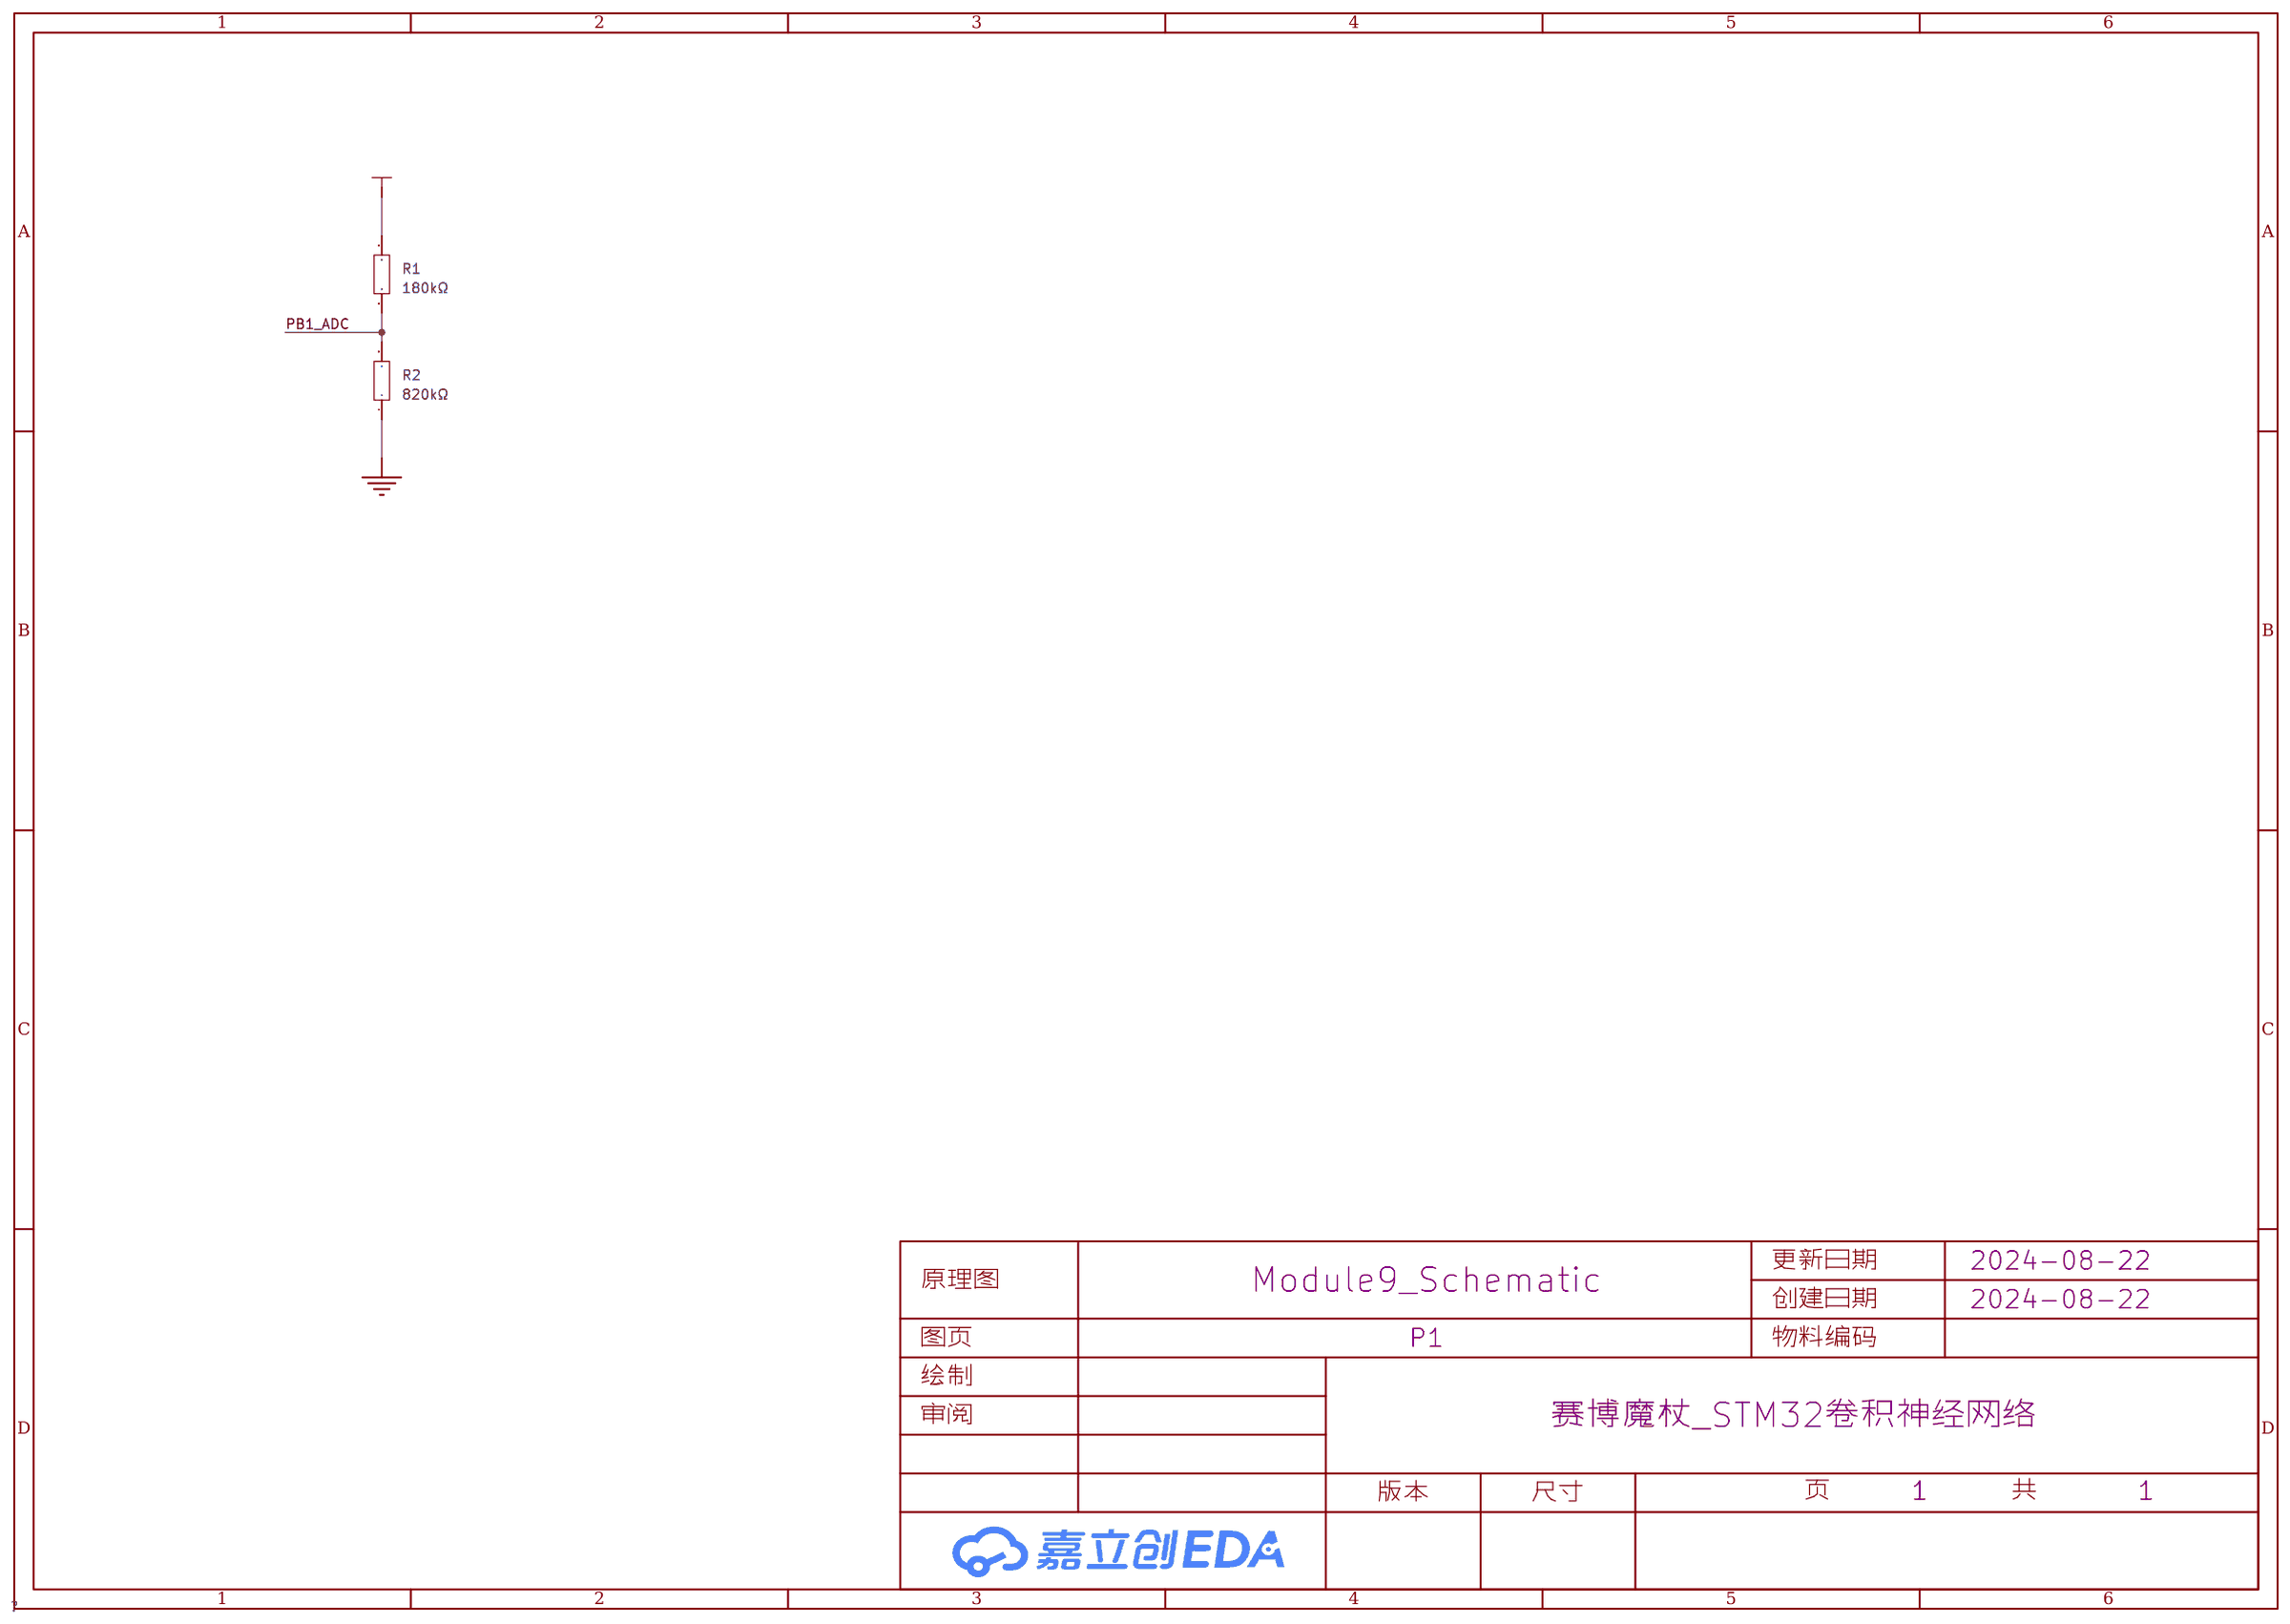
[diagram p9: schematic sheet]

## Parts
R1  180kΩ  [R0603]
R2  820kΩ  [R0603]

## Library data of the parts
R1 R2 = 0603WAF9103T5E: 电阻类型:厚膜电阻;阻值:910kΩ;精度:±1%;功率:100mW;最大工作电压:75V;温度系数:±100ppm/℃;; LCSC Part Name: 910kΩ ±1% 100mW 厚膜电阻; Supplier Part: C23263; Manufacturer: UNI-ROYAL(厚声); Supplier Footprint: 0603; JLCPCB Part Class: 扩展库; Datasheet: https://atta.szlcsc.com/upload/public/pdf/source/20200306/C422600_1E6D84923E4A46A82E41ADD87F860B5C.pdf; Supplier: LCSC; Type: 厚膜电阻; Tolerance: ±1%; Power(Watts): 100mW; Overload Voltage (Max): 75V; Temperature Coefficient: ±100ppm/℃; Operating Temperature Range: -55℃~+155℃

## Nets
3V3: R1.1
GND: R2.1
PB1_ADC: R1.2 R2.2

# Schematic RF_315
Board Name: RF_315; Create Date: 2024-08-22; Page Name: P1; Project Name: 赛博魔杖_STM32卷积神经网络; Schematic Name: RF_315; Update Date: 2024-08-22
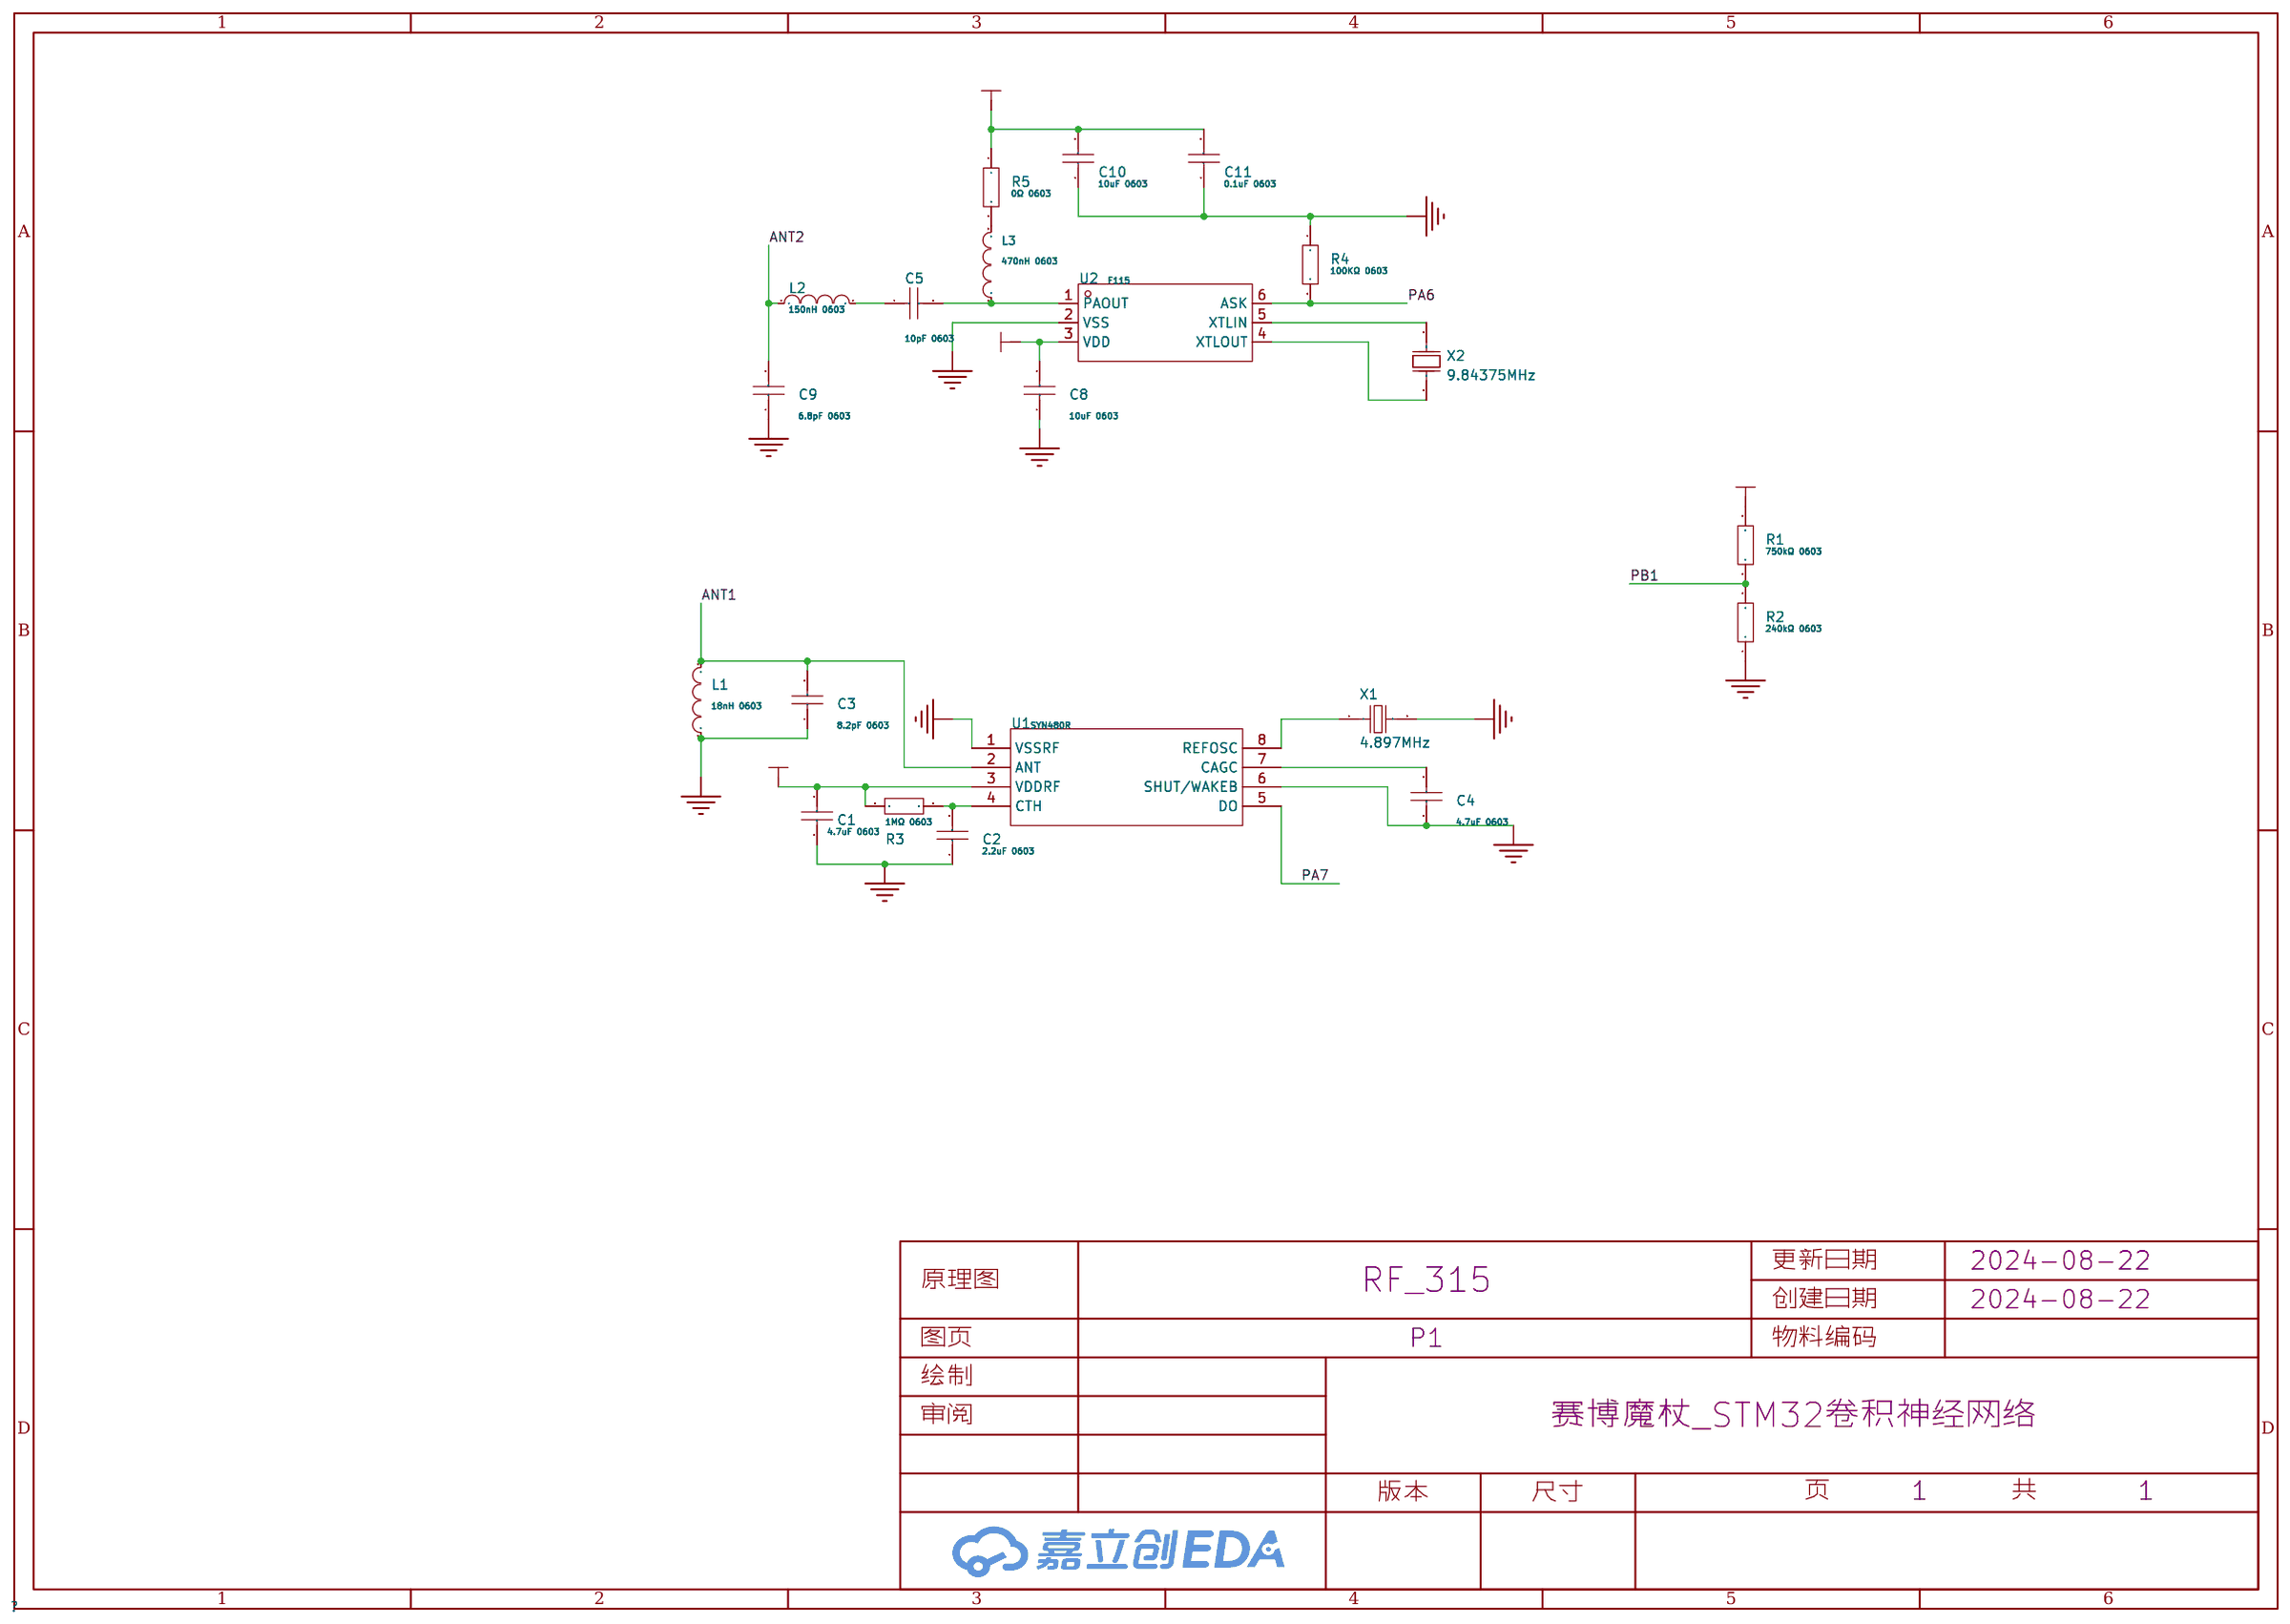
[diagram p10: schematic sheet]

## Parts
C1  4.7uF 0603  [C0603]
C2  2.2uF 0603  [C0603]
C3  8.2pF 0603  [C0603]
C4  4.7uF 0603  [C0603]
C5  10pF 0603  [C0603]
C8  10uF 0603  [C0603]
C9  6.8pF 0603  [C0603]
C10  10uF 0603  [C0603]
C11  0.1uF 0603  [C0603]
L1  18nH 0603  [L0603]
L2  150nH 0603  [L0603]
L3  470nH 0603  [L0603]
R1  750kΩ 0603  [R0603]
R2  240kΩ 0603  [R0603]
R3  1MΩ 0603  [R0603]
R4  100KΩ 0603  [R0603]
R5  0Ω 0603  [R0603]
U1  SYN480R  [SOIC-8_L5.0-W4.0-P1.27-LS6.0-BL]
U2  F115  [SOT-23-6_L2.9-W1.6-P0.95-LS2.8-BR]
X1  4.897MHz  [HC-49S_L11.0-W4.7-P4.88]
X2  9.84375MHz  [HC-49S_L11.0-W4.7-P4.88]

## Library data of the parts
C1 C2 C4 C8 C10 C11 = CL10A475KO8NNNC: 容值:4.7uF;精度:±10%;额定电压:16V;材质(温度系数):X5R;; LCSC Part Name: 4.7uF ±10% 16V; Supplier Part: C19666; Manufacturer: SAMSUNG(三星); Supplier Footprint: 0603; JLCPCB Part Class: 基础库; Datasheet: https://atta.szlcsc.com/upload/public/pdf/source/20160218/1457707763339.pdf; Supplier: LCSC; Tolerance: ±10%; Voltage Rated: 16V; Temperature Coefficient: X5R
C3 C9 = 0603CG8R2C500NT: 容值:8.2pF;额定电压:50V;材质(温度系数):C0G;; LCSC Part Name: 8.2pF 50V; Supplier Part: C1685; Manufacturer: FH(风华); Supplier Footprint: 0603; JLCPCB Part Class: 扩展库; Datasheet: https://atta.szlcsc.com/upload/public/pdf/source/20200305/C486355_26A10D38EF8C2A5C37091D0039909270.pdf; Supplier: LCSC; Voltage Rated: 50V; Temperature Coefficient: C0G
C5 = CC0603JRNPO9BN100: 容值:10pF;精度:±5%;额定电压:50V;材质(温度系数):NP0;; LCSC Part Name: 10pF ±5% 50V; Supplier Part: C106245; Manufacturer: YAGEO(国巨); Supplier Footprint: 0603; JLCPCB Part Class: 扩展库; Datasheet: https://atta.szlcsc.com/upload/public/pdf/source/20170505/1493957838062.pdf; Supplier: LCSC; Tolerance: ±5%; Voltage Rated: 50V; Temperature Coefficient: NP0
L1 = SDCL1608C18NJTDF: 电感值:18nH;精度:±5%;额定电流:300mA;饱和电流(Isat):-;直流电阻(DCR):550mΩ;; LCSC Part Name: 18nH ±5%; Supplier Part: C48590; Manufacturer: Sunlord(顺络); Supplier Footprint: 0603; JLCPCB Part Class: 扩展库; Datasheet: https://atta.szlcsc.com/upload/public/pdf/source/20231027/6126A3AAC5912C34388756BE22DEE00C.pdf; Supplier: LCSC; Tolerance: ±5%; Rated Current: 300mA; DC Resistance (DCR): 550mΩ; Q @ Freq: 12@100MHz; Frequency - Self Resonant: 2.2GHz
L2 = SCC1608C82NJSP: 电感值:82nH;精度:±5%;额定电流:300mA;饱和电流(Isat):-;直流电阻(DCR):1Ω;; LCSC Part Name: 82nH ±5%; Supplier Part: C412043; Manufacturer: Sunltech(韩国顺磁); Supplier Footprint: 0603; JLCPCB Part Class: 扩展库; Datasheet: https://atta.szlcsc.com/upload/public/pdf/source/20190819/C412052_7E47CA9107AD18C13168C896A90007C8.pdf; Supplier: LCSC; Tolerance: ±5%; Rated Current: 300mA; DC Resistance (DCR): 1Ω
L3 = LQW18ANR47G00D: 电感值:470nH;精度:±2%;额定电流:75mA;饱和电流(Isat):-;; LCSC Part Name: 470nH ±2%; Supplier Part: C113132; Manufacturer: muRata(村田); Supplier Footprint: 0603; JLCPCB Part Class: 扩展库; Datasheet: https://atta.szlcsc.com/upload/public/pdf/source/20180326/C77127_CBB089AEA7AD2ECBE76B6A055087DE79.pdf; Supplier: LCSC; Tolerance: ±2%; Rated Current: 75mA; DC Resistance (DCR): 7Ω
R1 R2 = 0603WAF1002T5E: 电阻类型:厚膜电阻;阻值:10kΩ;精度:±1%;功率:100mW;最大工作电压:75V;温度系数:±100ppm/℃;; LCSC Part Name: 厚膜电阻 10kΩ ±1% 100mW; Supplier Part: C25804; Manufacturer: UNI-ROYAL(厚声); Supplier Footprint: 0603; JLCPCB Part Class: 基础库; Datasheet: https://atta.szlcsc.com/upload/public/pdf/source/20200306/C422600_1E6D84923E4A46A82E41ADD87F860B5C.pdf; Supplier: LCSC; Type: 厚膜电阻; Tolerance: ±1%; Power(Watts): 100mW; Overload Voltage (Max): 75V; Temperature Coefficient: ±100ppm/℃; Operating Temperature Range: -55℃~+155℃
R3-R5 = 0603WAF1004T5E: 电阻类型:厚膜电阻;阻值:1MΩ;精度:±1%;功率:100mW;最大工作电压:75V;温度系数:±100ppm/℃;; LCSC Part Name: 1MΩ ±1% 100mW 厚膜电阻; Supplier Part: C22935; Manufacturer: UNI-ROYAL(厚声); Supplier Footprint: 0603; JLCPCB Part Class: 基础库; Datasheet: https://atta.szlcsc.com/upload/public/pdf/source/20200306/C422600_1E6D84923E4A46A82E41ADD87F860B5C.pdf; Supplier: LCSC; Type: 厚膜电阻; Tolerance: ±1%; Power(Watts): 100mW; Overload Voltage (Max): 75V; Temperature Coefficient: ±100ppm/℃; Operating Temperature Range: -55℃~+155℃
U1 = SYN480R_C15561: 原：SYN480R-FS24; LCSC Part Name: 单片ASK/OOK射频接收器IC; Supplier Part: C15561; Manufacturer: Synoxo; Supplier Footprint: SOIC-8; JLCPCB Part Class: 扩展库; Supplier: LCSC
U2 = F115: Supplier Part: C3010244; Manufacturer: Synoxo; Supplier Footprint: SOT-23-6; JLCPCB Part Class: 扩展库; Datasheet: https://atta.szlcsc.com/upload/public/pdf/source/20220518/DB87B9C28F482D3C116CF55472C82304.pdf; Supplier: LCSC
X1 = LOPAD04897U11L: 晶振类型:插件晶振;频率:4.897MHz;常温频差:±20ppm;外接负载电容:20pF;; LCSC Part Name: 4.897MHz ±20ppm 20pF; Supplier Part: C5344964; Manufacturer: Lucki(蓝晶); Supplier Footprint: HC-49S; JLCPCB Part Class: 扩展库; Datasheet: https://atta.szlcsc.com/upload/public/pdf/source/20221230/8CBEB3BF614E139FDE5D5FC9BB224CE3.pdf; Supplier: LCSC; Crystal Type: 插件晶振; Normal temperature Frequency Tolerance: ±20ppm; External load capacitor: 20pF; Operating Temperature: -40℃~+85℃
X2 = 9AC98437182080: 晶振类型:直插晶振;频率:9.84375MHz;常温频差:±20ppm;外接负载电容:20pF;; LCSC Part Name: 9.84375MHz ±20ppm 20pF; Supplier Part: C1508965; Manufacturer: JGHC(晶光华); Supplier Footprint: HC-49S; JLCPCB Part Class: 扩展库; Datasheet: https://atta.szlcsc.com/upload/public/pdf/source/20210105/C1508965_D7120E964E1F1AA3FF0DC91E675C06C8.pdf; Supplier: LCSC; Crystal Type: 直插晶振; Normal temperature Frequency Tolerance: ±20ppm; External load capacitor: 20pF; Equivalent Series Resistance (ESR): 80Ω; Operating Temperature: -40℃~+85℃

## Nets
3V3: C1.1 C8.2 C10.2 C11.2 R1.2 R3.2 R5.1 U1.3(VDDRF) U2.3(VDD)
GND: C1.2 C2.1 C3.1 C4.1 C8.1 C9.1 C10.1 C11.1 L1.1 R2.1 R4.1 U1.1(VSSRF) U1.6(SHUT/WAKEB) U2.2(VSS) X1.2
ANT1: C3.2 L1.2 U1.2(ANT)
ANT2: C9.2 L2.1
PA6: R4.2 U2.6(ASK)
PA7: U1.5(DO)
PB1: R1.1 R2.2
$1N1077: C2.2 R3.1 U1.4(CTH)
$1N1101: U1.8(REFOSC) X1.1
$1N1103: C4.2 U1.7(CAGC)
$1N1114: C5.2 L3.1 U2.1(PAOUT)
$1N1117: C5.1 L2.2
$1N5451: L3.2 R5.2
$1N7729: U2.5(XTLIN) X2.2(OSC2)
$1N7737: U2.4(XTLOUT) X2.1(OSC1)

# Schematic RF_433
Board Name: RF_433; Create Date: 2024-08-22; Page Name: P1; Project Name: 赛博魔杖_STM32卷积神经网络; Schematic Name: RF_433; Update Date: 2024-08-22
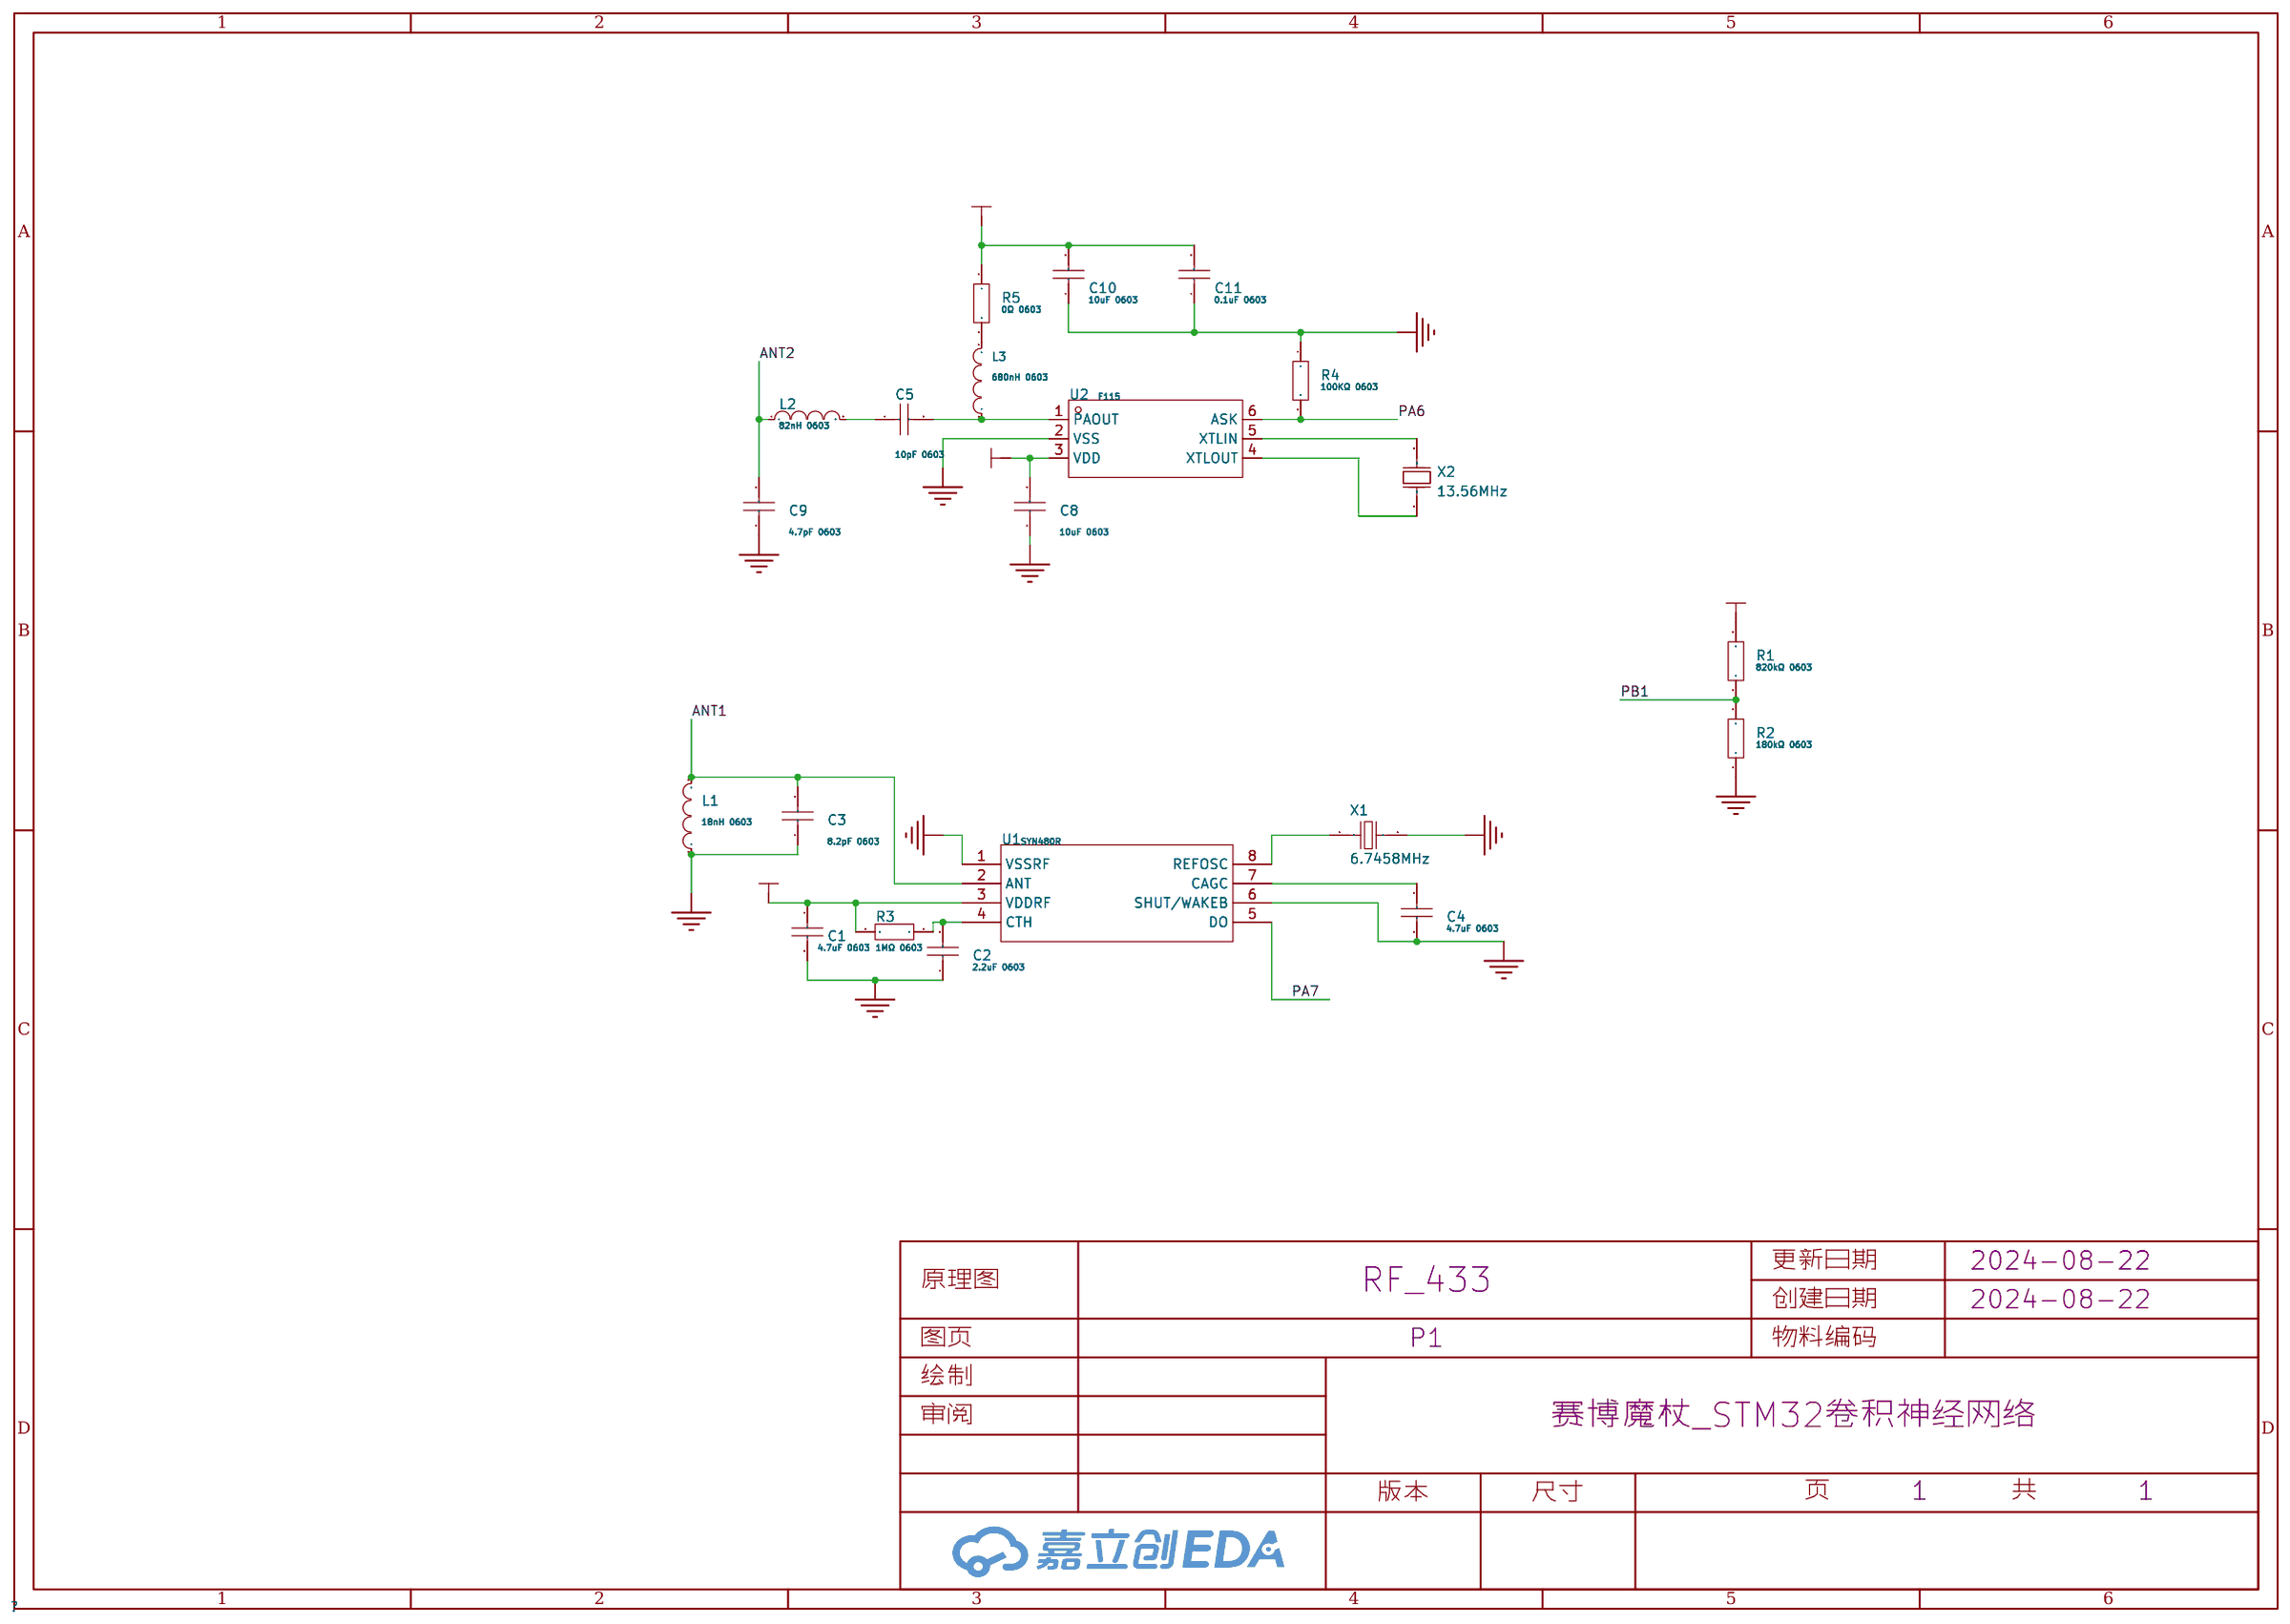
[diagram p11: schematic sheet]

## Parts
C1  4.7uF 0603  [C0603]
C2  2.2uF 0603  [C0603]
C3  8.2pF 0603  [C0603]
C4  4.7uF 0603  [C0603]
C5  10pF 0603  [C0603]
C8  10uF 0603  [C0603]
C9  4.7pF 0603  [C0603]
C10  10uF 0603  [C0603]
C11  0.1uF 0603  [C0603]
L1  18nH 0603  [L0603]
L2  82nH 0603  [L0603]
L3  680nH 0603  [L0603]
R1  820kΩ 0603  [R0603]
R2  180kΩ 0603  [R0603]
R3  1MΩ 0603  [R0603]
R4  100KΩ 0603  [R0603]
R5  0Ω 0603  [R0603]
U1  SYN480R  [SOIC-8_L5.0-W4.0-P1.27-LS6.0-BL]
U2  F115  [SOT-23-6_L2.9-W1.6-P0.95-LS2.8-BR]
X1  6.7458MHz  [HC-49S_L11.0-W4.7-P4.88]
X2  13.56MHz  [HC-49S_L11.0-W4.7-P4.88]

## Library data of the parts
C1 C2 C4 C8 C10 C11 = CL10A475KO8NNNC: 容值:4.7uF;精度:±10%;额定电压:16V;材质(温度系数):X5R;; LCSC Part Name: 4.7uF ±10% 16V; Supplier Part: C19666; Manufacturer: SAMSUNG(三星); Supplier Footprint: 0603; JLCPCB Part Class: 基础库; Datasheet: https://atta.szlcsc.com/upload/public/pdf/source/20160218/1457707763339.pdf; Supplier: LCSC; Tolerance: ±10%; Voltage Rated: 16V; Temperature Coefficient: X5R
C3 C9 = 0603CG8R2C500NT: 容值:8.2pF;额定电压:50V;材质(温度系数):C0G;; LCSC Part Name: 8.2pF 50V; Supplier Part: C1685; Manufacturer: FH(风华); Supplier Footprint: 0603; JLCPCB Part Class: 扩展库; Datasheet: https://atta.szlcsc.com/upload/public/pdf/source/20200305/C486355_26A10D38EF8C2A5C37091D0039909270.pdf; Supplier: LCSC; Voltage Rated: 50V; Temperature Coefficient: C0G
C5 = CC0603JRNPO9BN100: 容值:10pF;精度:±5%;额定电压:50V;材质(温度系数):NP0;; LCSC Part Name: 10pF ±5% 50V; Supplier Part: C106245; Manufacturer: YAGEO(国巨); Supplier Footprint: 0603; JLCPCB Part Class: 扩展库; Datasheet: https://atta.szlcsc.com/upload/public/pdf/source/20170505/1493957838062.pdf; Supplier: LCSC; Tolerance: ±5%; Voltage Rated: 50V; Temperature Coefficient: NP0
L1 = SDCL1608C18NJTDF: 电感值:18nH;精度:±5%;额定电流:300mA;饱和电流(Isat):-;直流电阻(DCR):550mΩ;; LCSC Part Name: 18nH ±5%; Supplier Part: C48590; Manufacturer: Sunlord(顺络); Supplier Footprint: 0603; JLCPCB Part Class: 扩展库; Datasheet: https://atta.szlcsc.com/upload/public/pdf/source/20231027/6126A3AAC5912C34388756BE22DEE00C.pdf; Supplier: LCSC; Tolerance: ±5%; Rated Current: 300mA; DC Resistance (DCR): 550mΩ; Q @ Freq: 12@100MHz; Frequency - Self Resonant: 2.2GHz
L2 = SCC1608C82NJSP: 电感值:82nH;精度:±5%;额定电流:300mA;饱和电流(Isat):-;直流电阻(DCR):1Ω;; LCSC Part Name: 82nH ±5%; Supplier Part: C412043; Manufacturer: Sunltech(韩国顺磁); Supplier Footprint: 0603; JLCPCB Part Class: 扩展库; Datasheet: https://atta.szlcsc.com/upload/public/pdf/source/20190819/C412052_7E47CA9107AD18C13168C896A90007C8.pdf; Supplier: LCSC; Tolerance: ±5%; Rated Current: 300mA; DC Resistance (DCR): 1Ω
L3 = LQW18ANR47G00D: 电感值:470nH;精度:±2%;额定电流:75mA;饱和电流(Isat):-;; LCSC Part Name: 470nH ±2%; Supplier Part: C113132; Manufacturer: muRata(村田); Supplier Footprint: 0603; JLCPCB Part Class: 扩展库; Datasheet: https://atta.szlcsc.com/upload/public/pdf/source/20180326/C77127_CBB089AEA7AD2ECBE76B6A055087DE79.pdf; Supplier: LCSC; Tolerance: ±2%; Rated Current: 75mA; DC Resistance (DCR): 7Ω
R1 R2 = 0603WAF1002T5E: 电阻类型:厚膜电阻;阻值:10kΩ;精度:±1%;功率:100mW;最大工作电压:75V;温度系数:±100ppm/℃;; LCSC Part Name: 厚膜电阻 10kΩ ±1% 100mW; Supplier Part: C25804; Manufacturer: UNI-ROYAL(厚声); Supplier Footprint: 0603; JLCPCB Part Class: 基础库; Datasheet: https://atta.szlcsc.com/upload/public/pdf/source/20200306/C422600_1E6D84923E4A46A82E41ADD87F860B5C.pdf; Supplier: LCSC; Type: 厚膜电阻; Tolerance: ±1%; Power(Watts): 100mW; Overload Voltage (Max): 75V; Temperature Coefficient: ±100ppm/℃; Operating Temperature Range: -55℃~+155℃
R3-R5 = 0603WAF1004T5E: 电阻类型:厚膜电阻;阻值:1MΩ;精度:±1%;功率:100mW;最大工作电压:75V;温度系数:±100ppm/℃;; LCSC Part Name: 1MΩ ±1% 100mW 厚膜电阻; Supplier Part: C22935; Manufacturer: UNI-ROYAL(厚声); Supplier Footprint: 0603; JLCPCB Part Class: 基础库; Datasheet: https://atta.szlcsc.com/upload/public/pdf/source/20200306/C422600_1E6D84923E4A46A82E41ADD87F860B5C.pdf; Supplier: LCSC; Type: 厚膜电阻; Tolerance: ±1%; Power(Watts): 100mW; Overload Voltage (Max): 75V; Temperature Coefficient: ±100ppm/℃; Operating Temperature Range: -55℃~+155℃
U1 = SYN480R_C15561: 原：SYN480R-FS24; LCSC Part Name: 单片ASK/OOK射频接收器IC; Supplier Part: C15561; Manufacturer: Synoxo; Supplier Footprint: SOIC-8; JLCPCB Part Class: 扩展库; Supplier: LCSC
U2 = F115: Supplier Part: C3010244; Manufacturer: Synoxo; Supplier Footprint: SOT-23-6; JLCPCB Part Class: 扩展库; Datasheet: https://atta.szlcsc.com/upload/public/pdf/source/20220518/DB87B9C28F482D3C116CF55472C82304.pdf; Supplier: LCSC
X1 = LOPAD04897U11L: 晶振类型:插件晶振;频率:4.897MHz;常温频差:±20ppm;外接负载电容:20pF;; LCSC Part Name: 4.897MHz ±20ppm 20pF; Supplier Part: C5344964; Manufacturer: Lucki(蓝晶); Supplier Footprint: HC-49S; JLCPCB Part Class: 扩展库; Datasheet: https://atta.szlcsc.com/upload/public/pdf/source/20221230/8CBEB3BF614E139FDE5D5FC9BB224CE3.pdf; Supplier: LCSC; Crystal Type: 插件晶振; Normal temperature Frequency Tolerance: ±20ppm; External load capacitor: 20pF; Operating Temperature: -40℃~+85℃
X2 = 9AC98437182080: 晶振类型:直插晶振;频率:9.84375MHz;常温频差:±20ppm;外接负载电容:20pF;; LCSC Part Name: 9.84375MHz ±20ppm 20pF; Supplier Part: C1508965; Manufacturer: JGHC(晶光华); Supplier Footprint: HC-49S; JLCPCB Part Class: 扩展库; Datasheet: https://atta.szlcsc.com/upload/public/pdf/source/20210105/C1508965_D7120E964E1F1AA3FF0DC91E675C06C8.pdf; Supplier: LCSC; Crystal Type: 直插晶振; Normal temperature Frequency Tolerance: ±20ppm; External load capacitor: 20pF; Equivalent Series Resistance (ESR): 80Ω; Operating Temperature: -40℃~+85℃

## Nets
3V3: C1.1 C8.2 C10.2 C11.2 R1.2 R3.2 R5.1 U1.3(VDDRF) U2.3(VDD)
GND: C1.2 C2.1 C3.1 C4.1 C8.1 C9.1 C10.1 C11.1 L1.1 R2.1 R4.1 U1.1(VSSRF) U1.6(SHUT/WAKEB) U2.2(VSS) X1.2
ANT1: C3.2 L1.2 U1.2(ANT)
ANT2: C9.2 L2.1
PA6: R4.2 U2.6(ASK)
PA7: U1.5(DO)
PB1: R1.1 R2.2
$1N1077: C2.2 R3.1 U1.4(CTH)
$1N1101: U1.8(REFOSC) X1.1
$1N1103: C4.2 U1.7(CAGC)
$1N1114: C5.2 L3.1 U2.1(PAOUT)
$1N1117: C5.1 L2.2
$1N5451: L3.2 R5.2
$1N7729: U2.5(XTLIN) X2.2(OSC2)
$1N7737: U2.4(XTLOUT) X2.1(OSC1)
